# EAGLE schematic BoardSchem (EAGLE 9.6.2)

## Sheet 1 of 7: Power
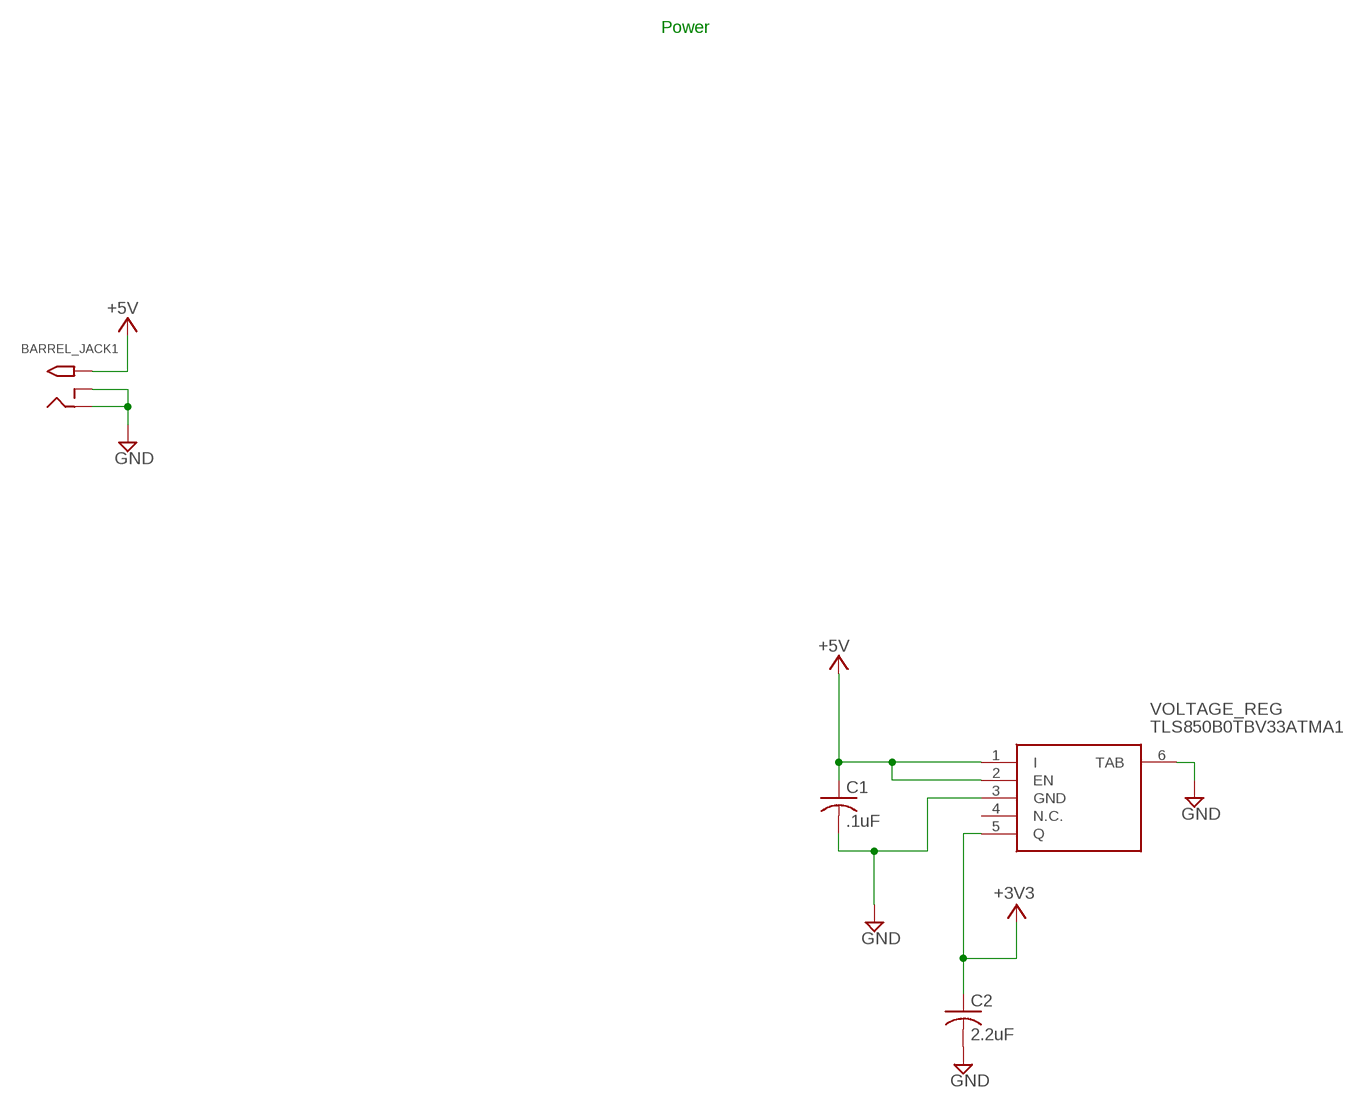
[diagram p0: schematic, sheet 1]

### Parts
BARREL_JACK1  2.1MMJACKTHM  [PJ-102A]
C1  .1uF  C-USC0805  [C0805]
C2  2.2uF  C-USC0805  [C0805]
VOLTAGE_REG  TLS850B0TBV33ATMA1  [TLS850B0TBV33ATMA1]

### Nets
+3V3: C2.1 VOLTAGE_REG.5(Q) ; also sheet 2
+5V: BARREL_JACK1.TIP C1.1 VOLTAGE_REG.1(I) VOLTAGE_REG.2(EN) ; also sheet 2,3,4,5,6,7
GND: BARREL_JACK1.RING BARREL_JACK1.RING_SW C1.2 C2.2 VOLTAGE_REG.3(GND) VOLTAGE_REG.6(TAB) ; also sheet 2,3,4,5,6,7
Unconnected: VOLTAGE_REG.4(N.C.)

### Notes on the sheet
- Power

## Sheet 2 of 7: Controling ICs
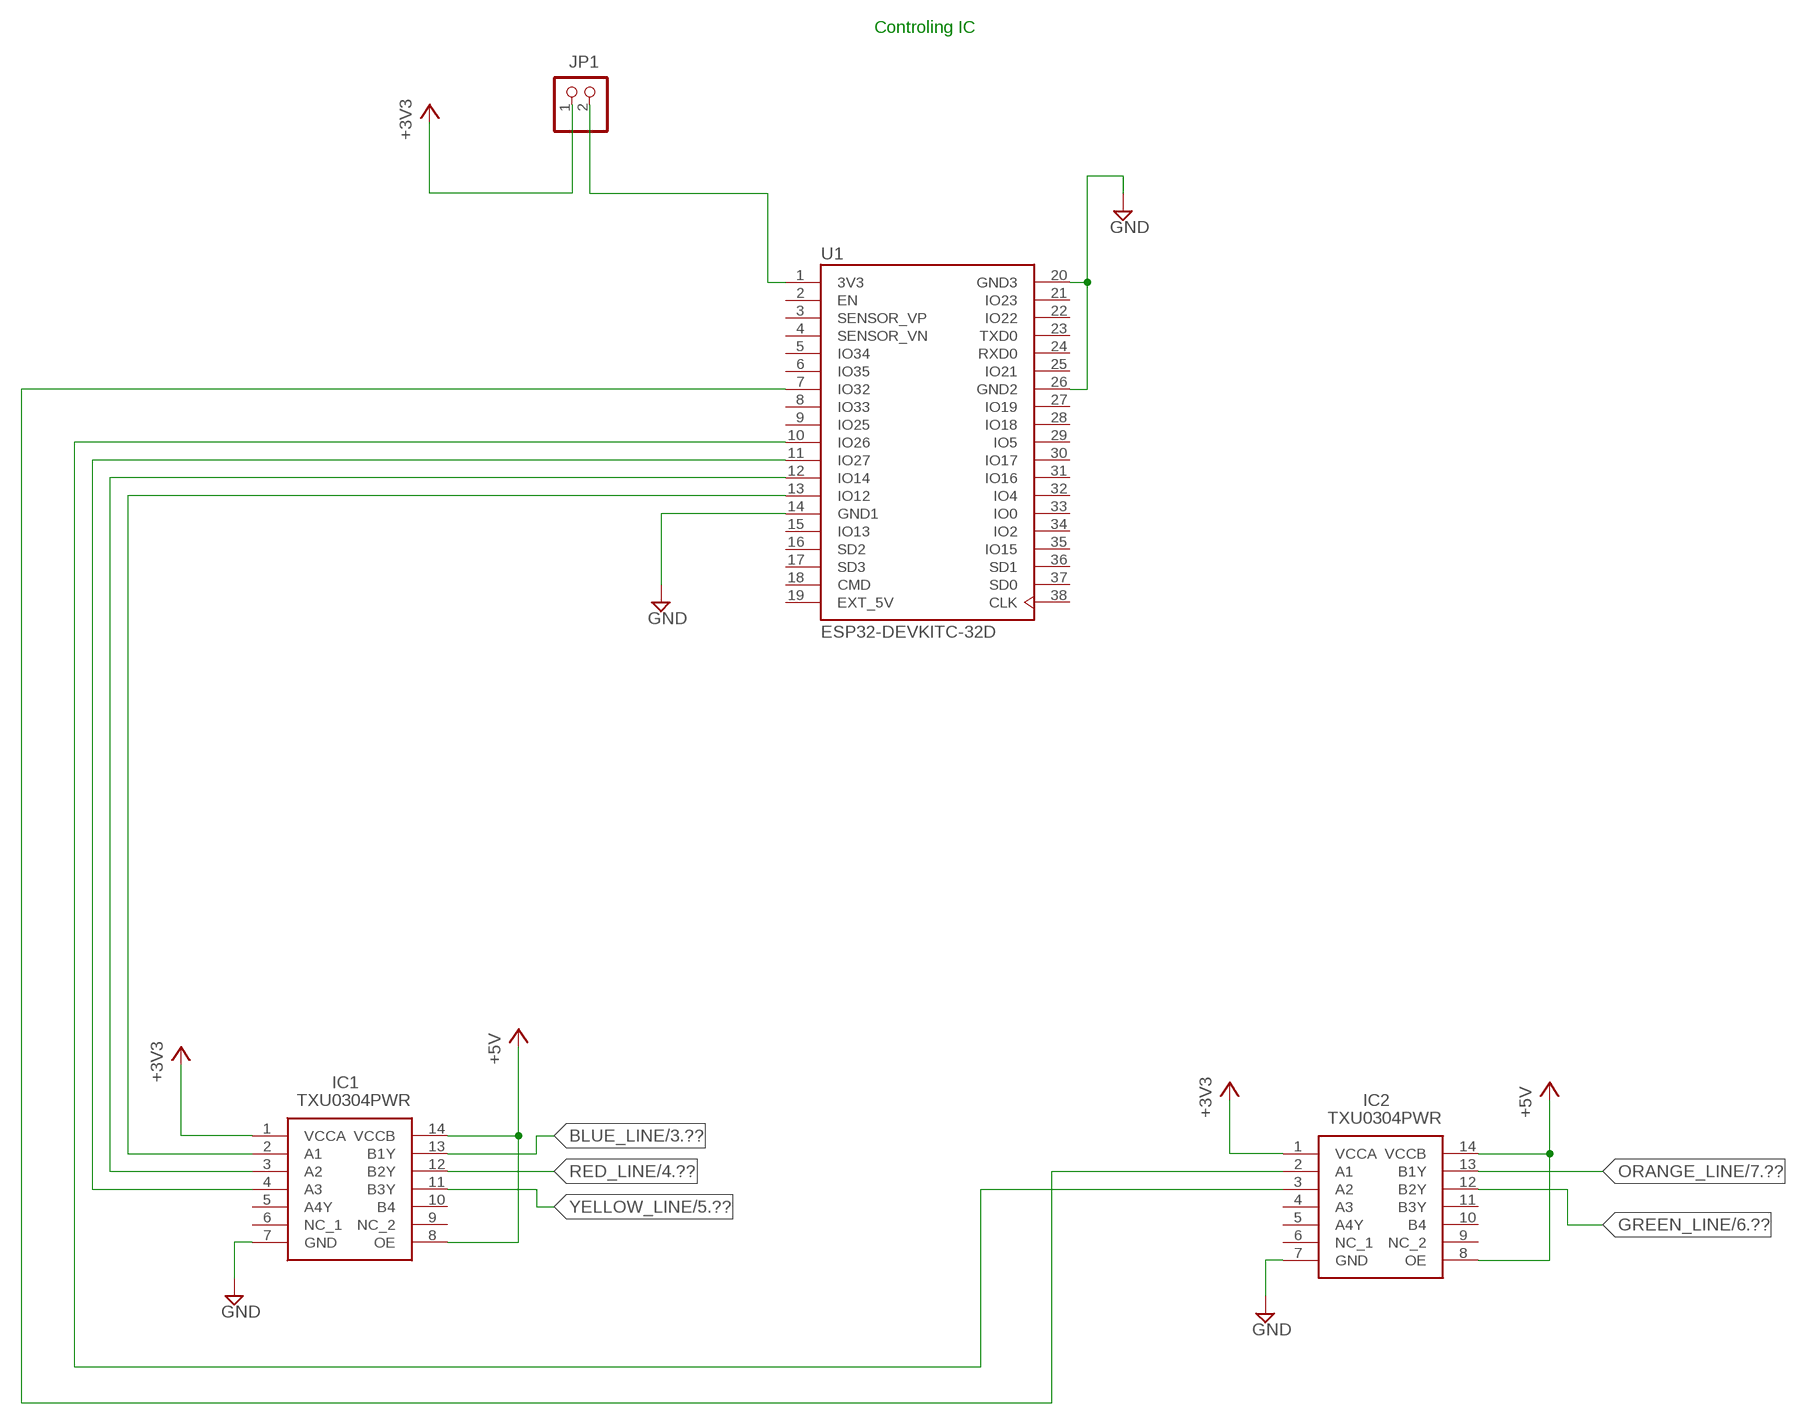
[diagram p1: schematic, sheet 2]

### Parts
IC1  TXU0304PWR  [SOP65P640X120-14N]
IC2  TXU0304PWR  [SOP65P640X120-14N]
JP1  PINHD-1X2  [1X02]
U1  ESP32-DEVKITC-32D  [MODULE_ESP32-DEVKITC-32D]

### Nets
+3V3: IC1.1(VCCA) IC2.1(VCCA) JP1.1 ; also sheet 1
+5V: IC1.8(OE) IC1.14(VCCB) IC2.8(OE) IC2.14(VCCB) ; also sheet 1,3,4,5,6,7
BLUE_LINE: IC1.13(B1Y) ; also sheet 3
GND: IC1.7(GND) IC2.7(GND) U1.14(GND1) U1.20(GND3) U1.26(GND2) ; also sheet 1,3,4,5,6,7
GREEN_LINE: IC2.12(B2Y) ; also sheet 6
N$1: JP1.2 U1.1(3V3)
N$141: IC1.2(A1) U1.13(IO12)
N$142: IC1.3(A2) U1.12(IO14)
N$144: IC1.4(A3) U1.11(IO27)
N$145: IC2.3(A2) U1.10(IO26)
N$146: IC2.2(A1) U1.7(IO32)
ORANGE_LINE: IC2.13(B1Y) ; also sheet 7
RED_LINE: IC1.12(B2Y) ; also sheet 4
YELLOW_LINE: IC1.11(B3Y) ; also sheet 5
Unconnected: IC1.5(A4Y) IC1.6(NC_1) IC1.9(NC_2) IC1.10(B4) IC2.4(A3) IC2.5(A4Y) IC2.6(NC_1) IC2.9(NC_2) IC2.10(B4) IC2.11(B3Y) U1.2(EN) U1.3(SENSOR_VP) U1.4(SENSOR_VN) U1.5(IO34) U1.6(IO35) U1.8(IO33) U1.9(IO25) U1.15(IO13) U1.16(SD2) U1.17(SD3) U1.18(CMD) U1.21(IO23) U1.22(IO22) U1.23(TXD0) U1.24(RXD0) U1.25(IO21) U1.27(IO19) U1.28(IO18) U1.29(IO5) U1.30(IO17) U1.31(IO16) U1.32(IO4) U1.33(IO0) U1.34(IO2) U1.35(IO15) U1.36(SD1) U1.37(SD0) U1.38(CLK)

### Notes on the sheet
- Controling IC

## Sheet 3 of 7: Blue Line
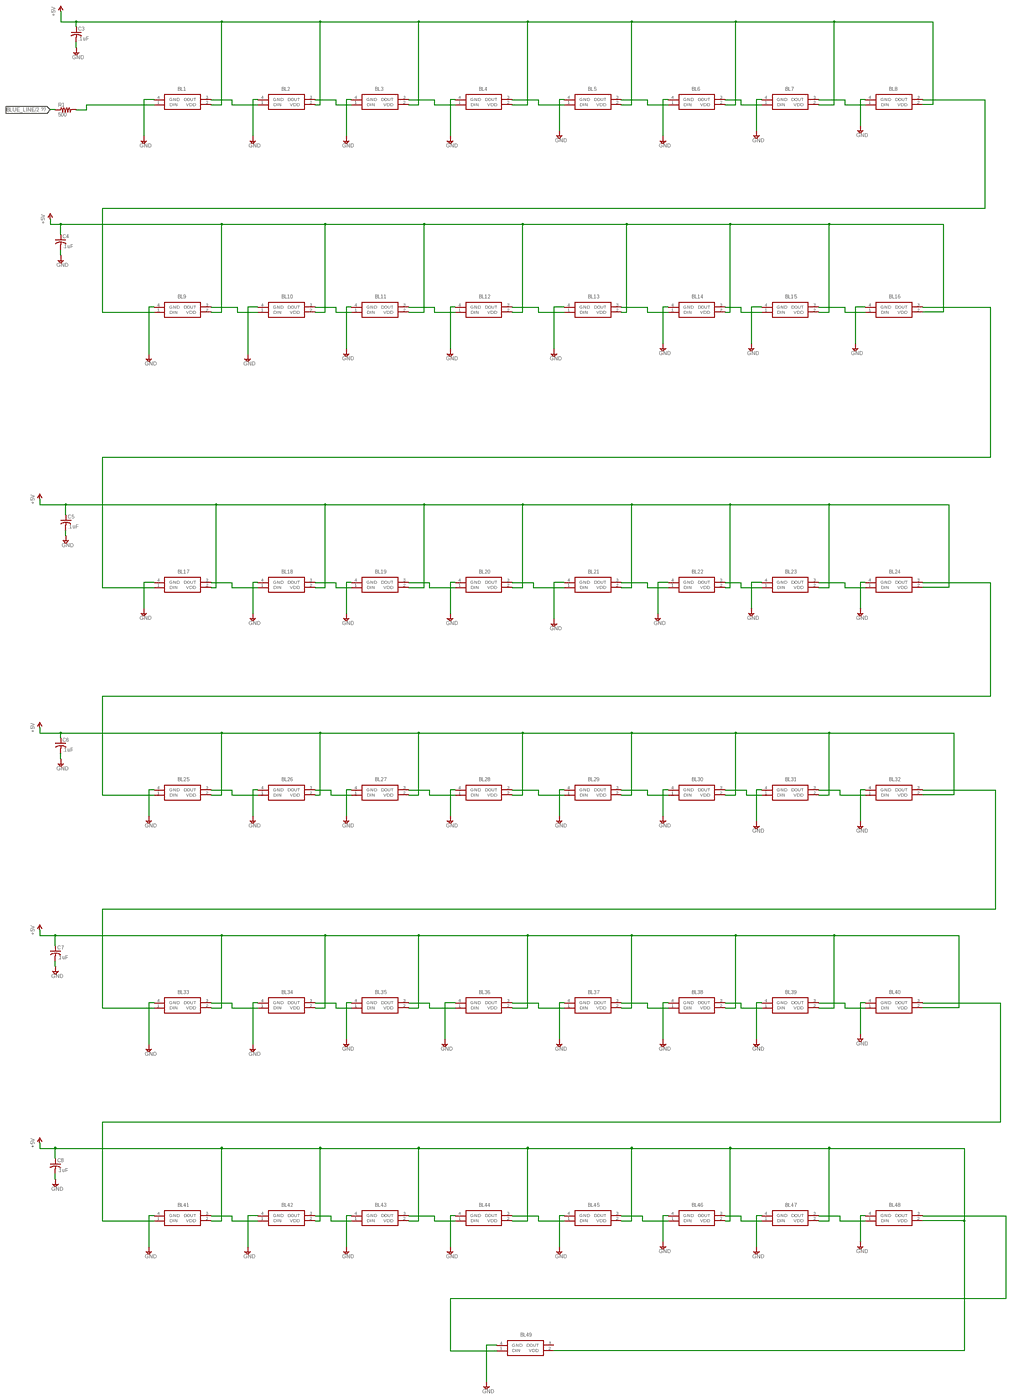
[diagram p2: schematic, sheet 3, overview]
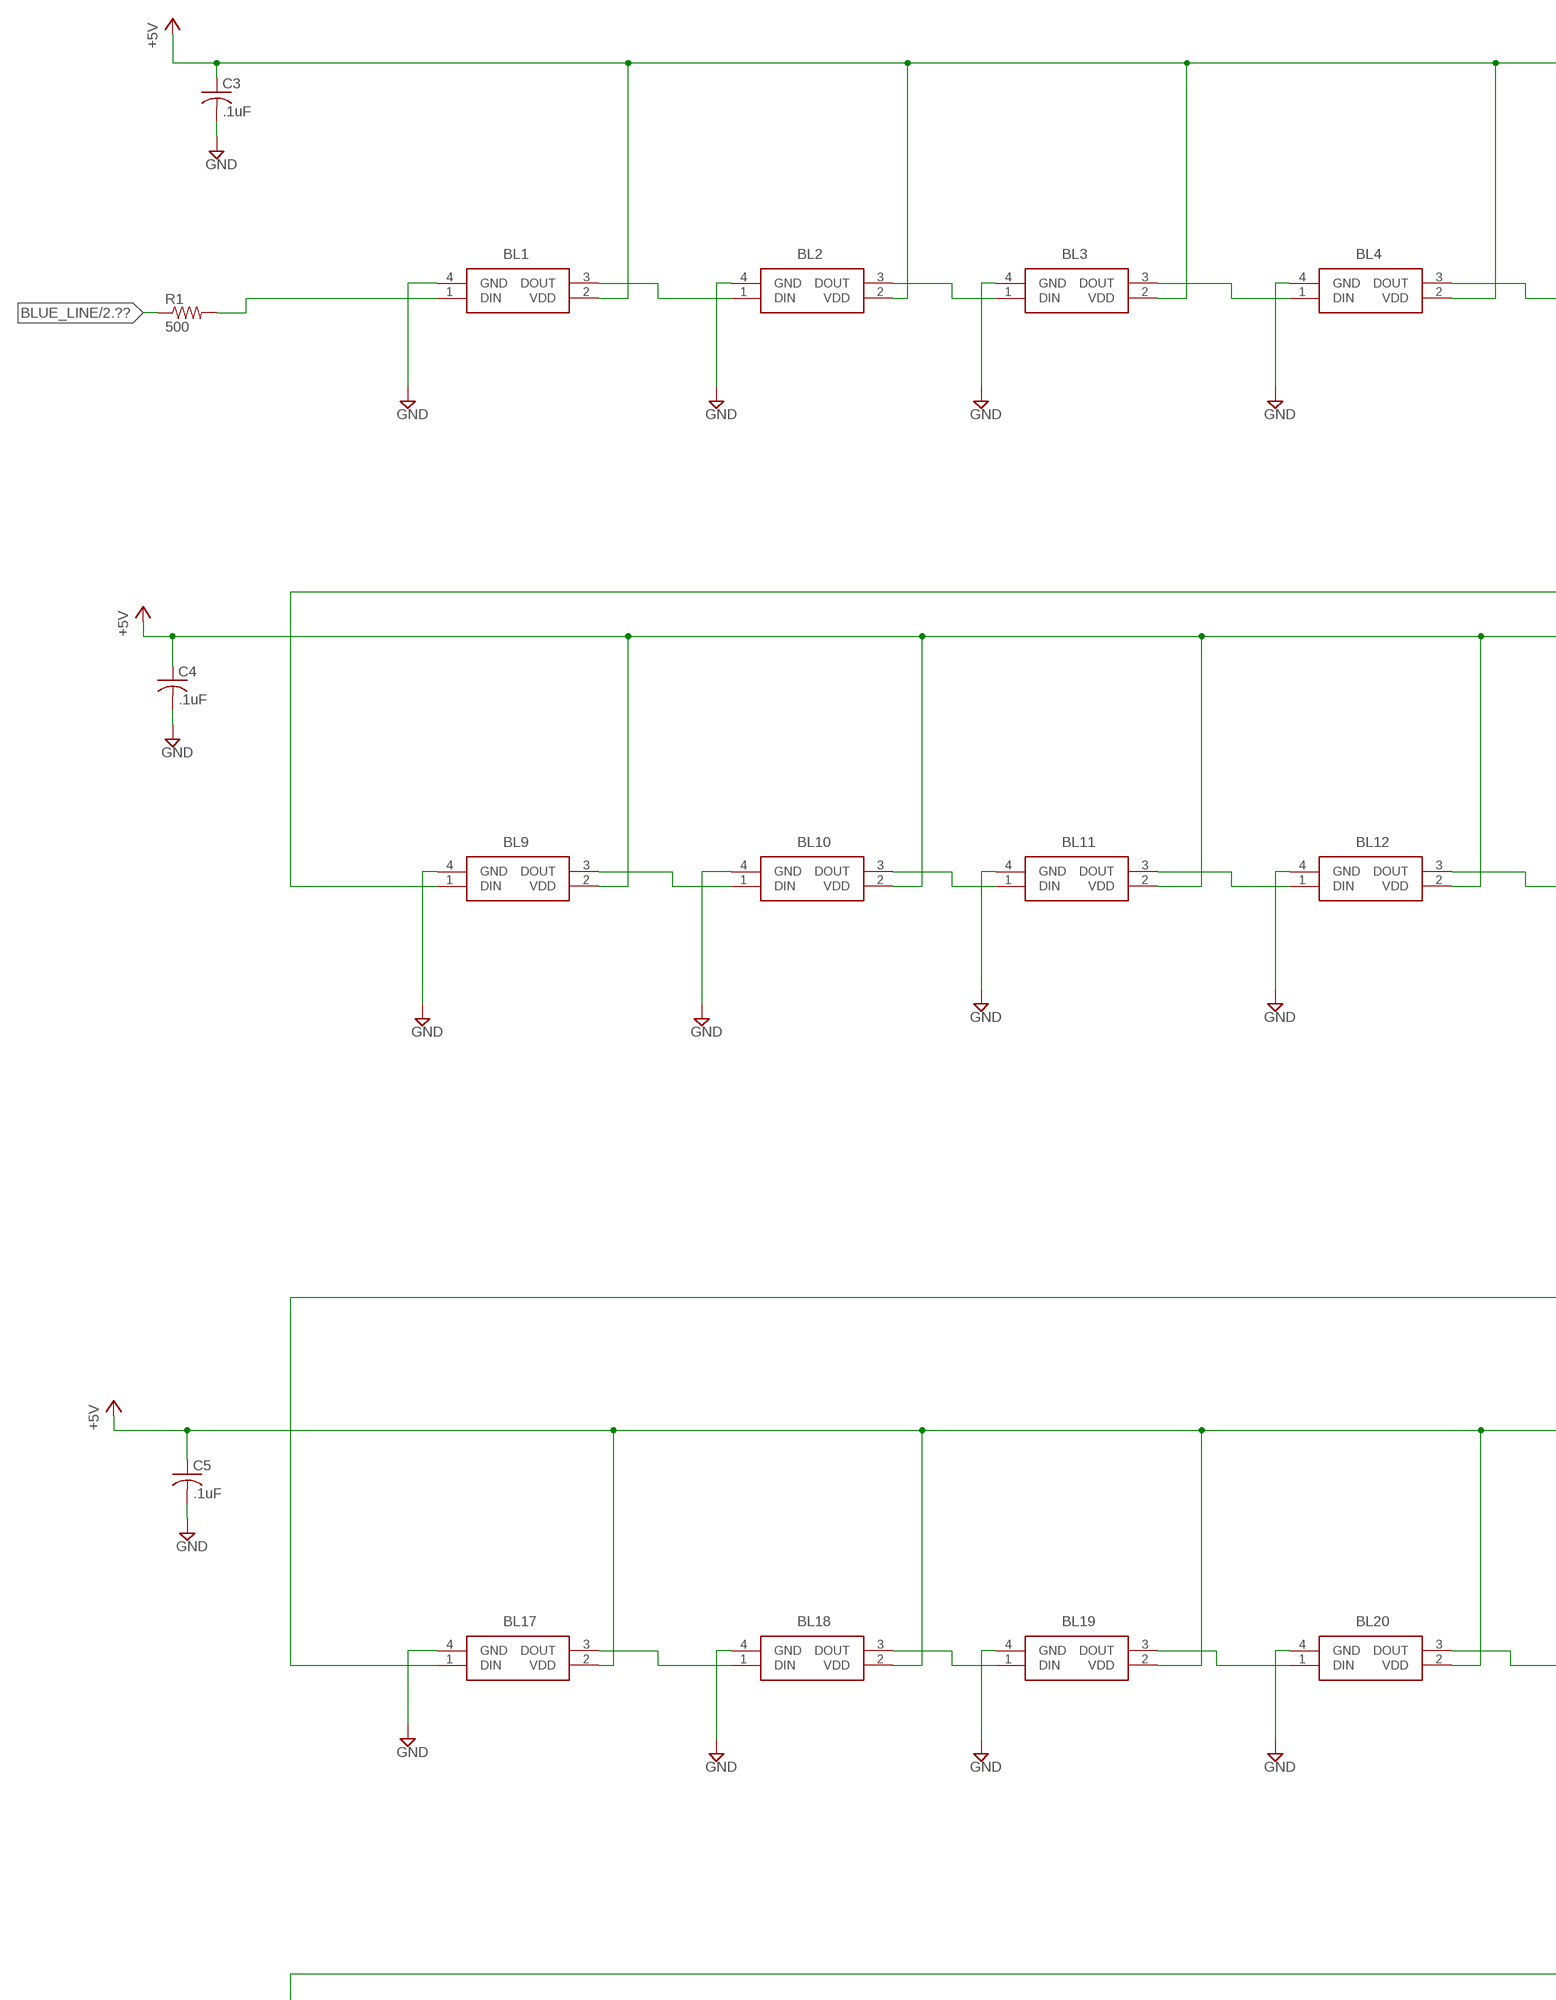
[diagram p3: schematic, sheet 3, part 1 of 4]
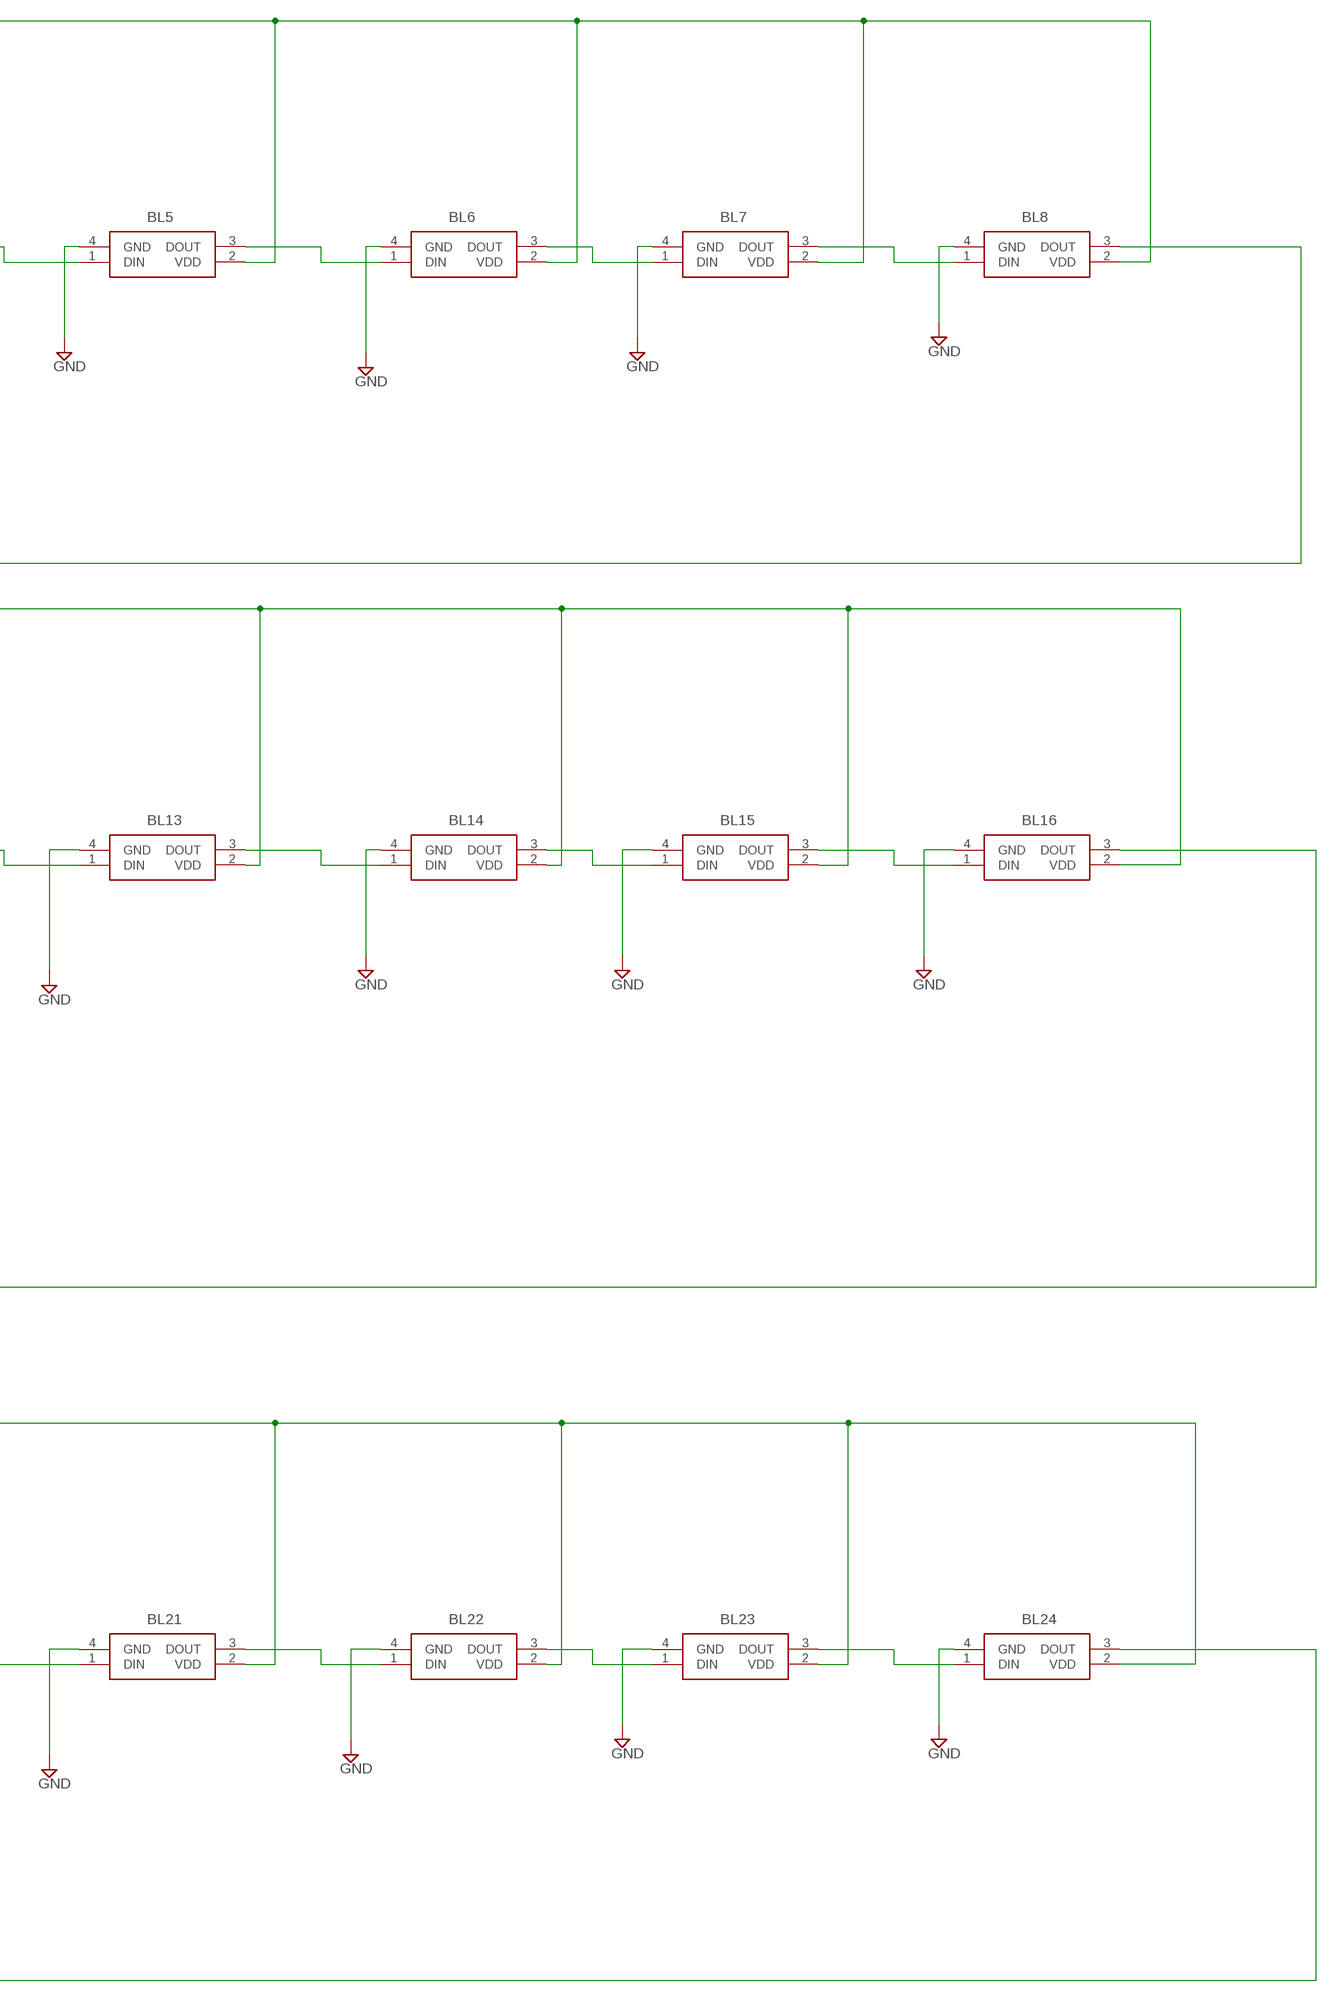
[diagram p4: schematic, sheet 3, part 2 of 4]
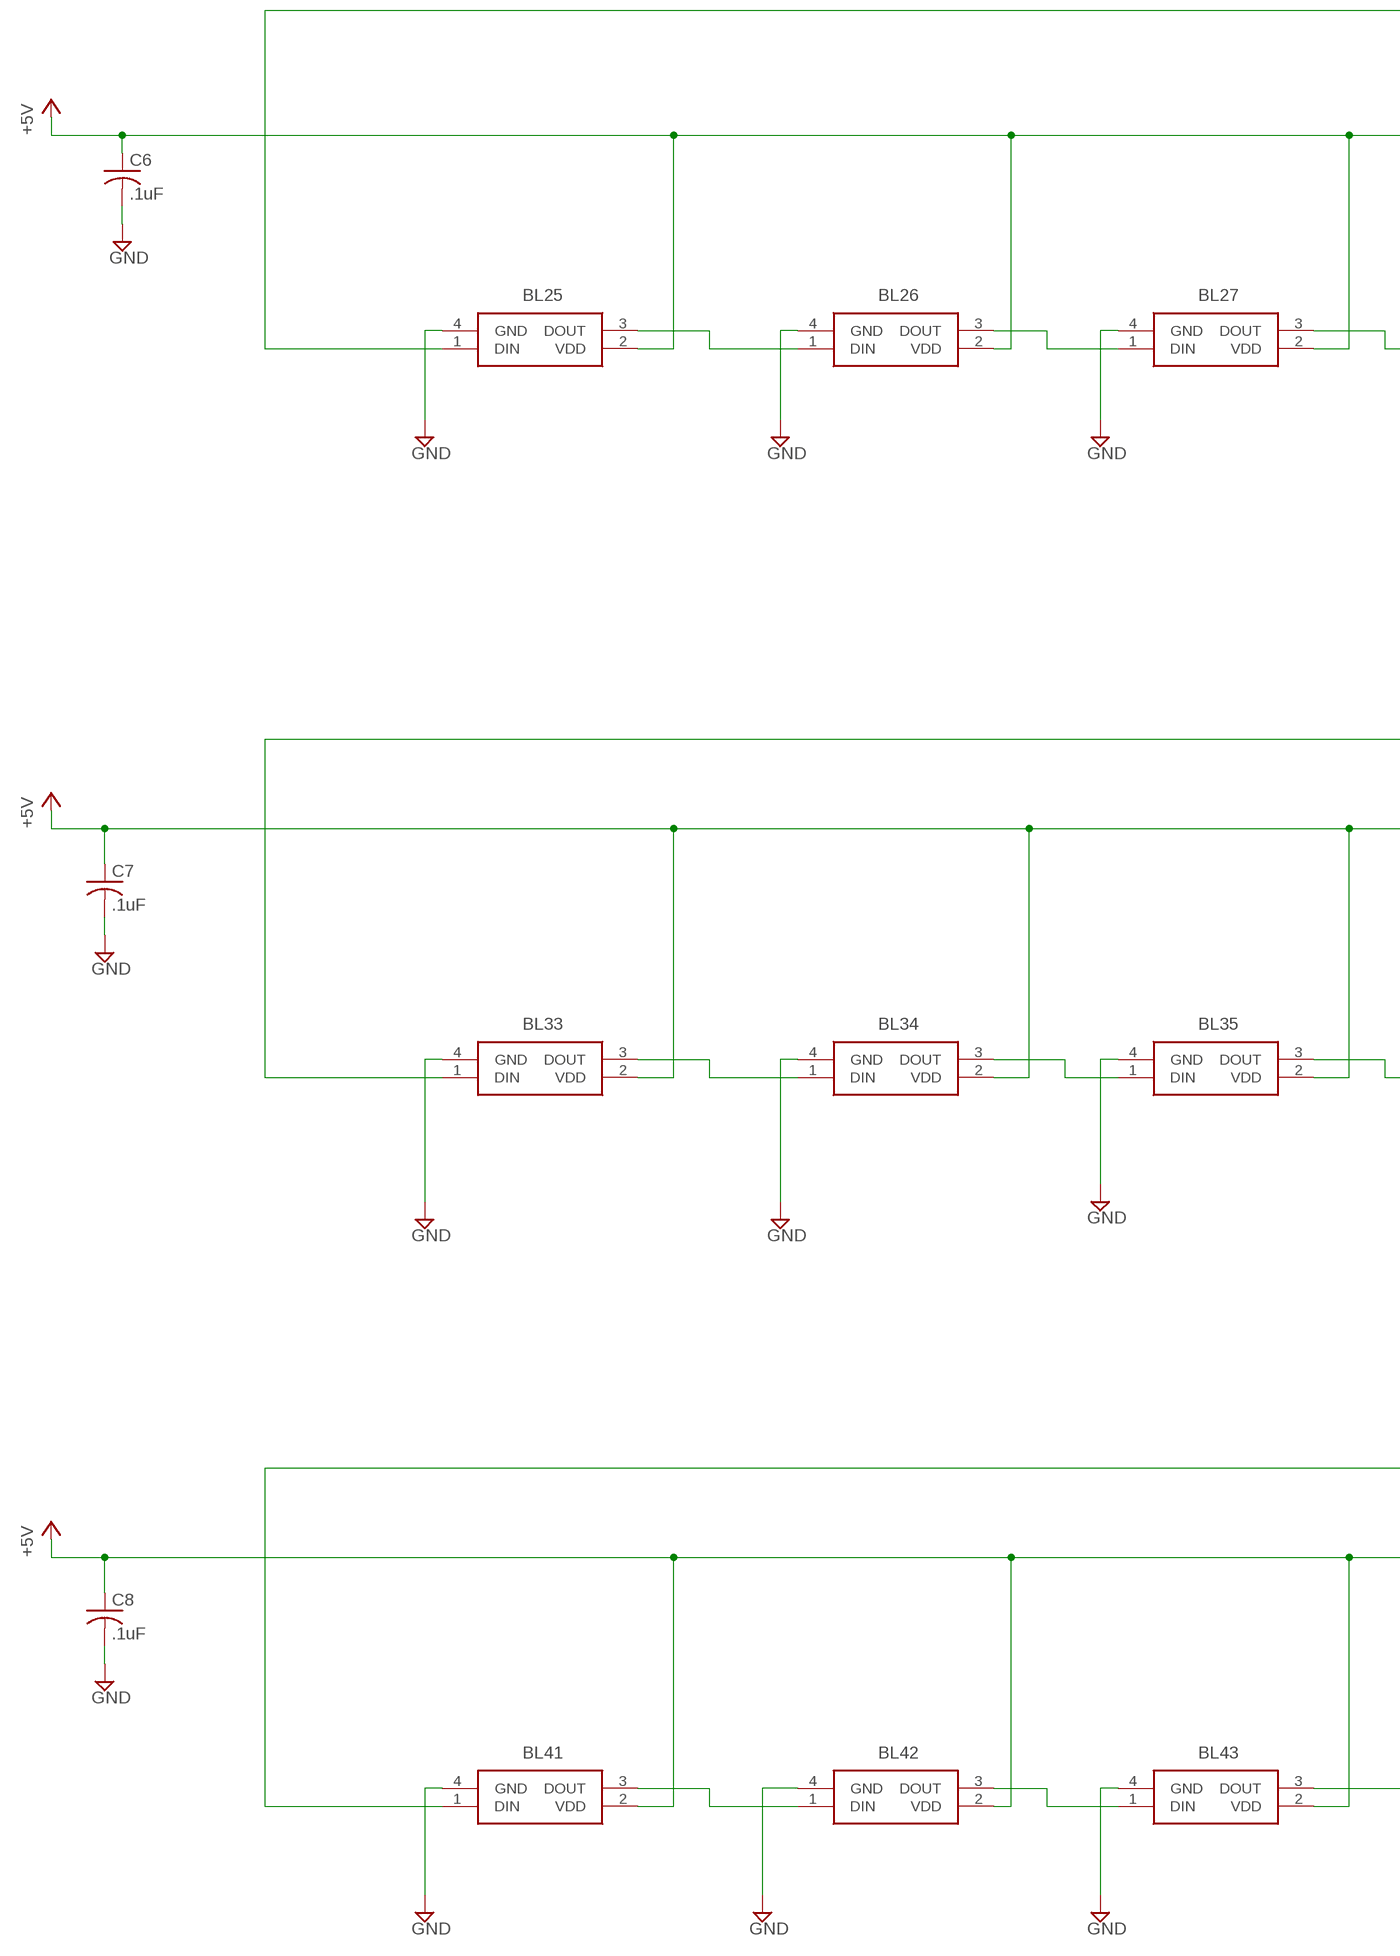
[diagram p5: schematic, sheet 3, part 3 of 4]
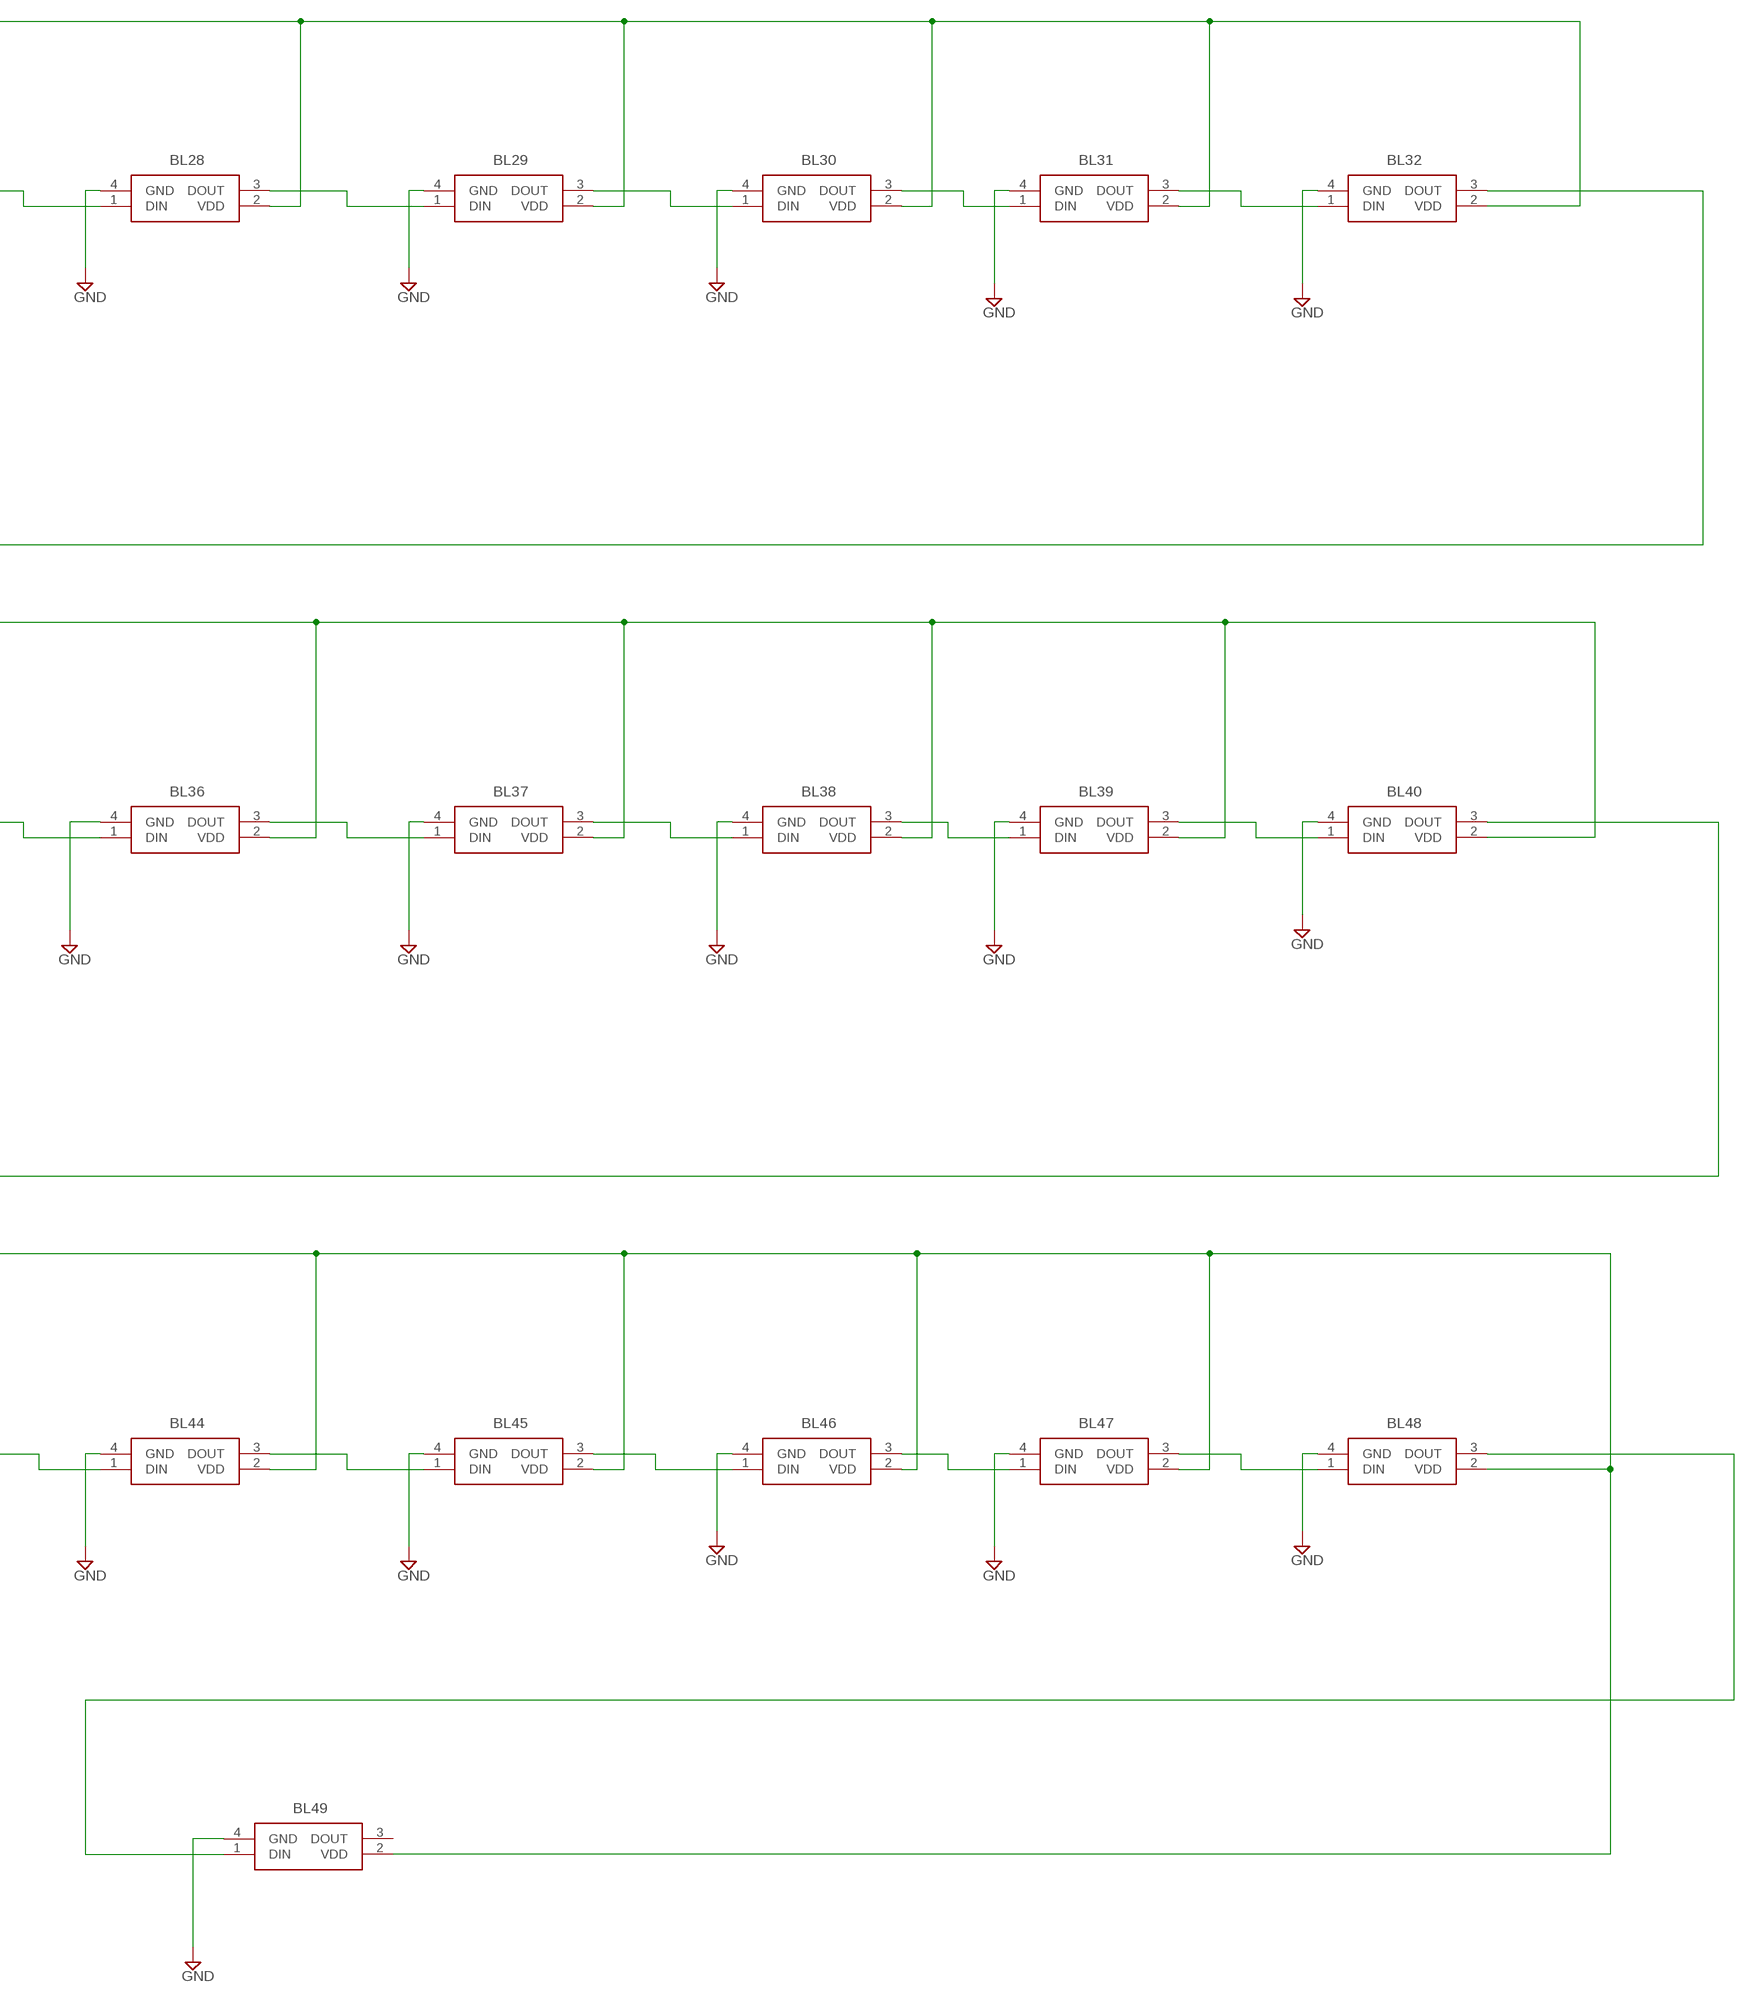
[diagram p6: schematic, sheet 3, part 4 of 4]

### Parts
BL1  4492__SK6805-EC_15_  [4492SK6805EC15]
BL2  4492__SK6805-EC_15_  [4492SK6805EC15]
BL3  4492__SK6805-EC_15_  [4492SK6805EC15]
BL4  4492__SK6805-EC_15_  [4492SK6805EC15]
BL5  4492__SK6805-EC_15_  [4492SK6805EC15]
BL6  4492__SK6805-EC_15_  [4492SK6805EC15]
BL7  4492__SK6805-EC_15_  [4492SK6805EC15]
BL8  4492__SK6805-EC_15_  [4492SK6805EC15]
BL9  4492__SK6805-EC_15_  [4492SK6805EC15]
BL10  4492__SK6805-EC_15_  [4492SK6805EC15]
BL11  4492__SK6805-EC_15_  [4492SK6805EC15]
BL12  4492__SK6805-EC_15_  [4492SK6805EC15]
BL13  4492__SK6805-EC_15_  [4492SK6805EC15]
BL14  4492__SK6805-EC_15_  [4492SK6805EC15]
BL15  4492__SK6805-EC_15_  [4492SK6805EC15]
BL16  4492__SK6805-EC_15_  [4492SK6805EC15]
BL17  4492__SK6805-EC_15_  [4492SK6805EC15]
BL18  4492__SK6805-EC_15_  [4492SK6805EC15]
BL19  4492__SK6805-EC_15_  [4492SK6805EC15]
BL20  4492__SK6805-EC_15_  [4492SK6805EC15]
BL21  4492__SK6805-EC_15_  [4492SK6805EC15]
BL22  4492__SK6805-EC_15_  [4492SK6805EC15]
BL23  4492__SK6805-EC_15_  [4492SK6805EC15]
BL24  4492__SK6805-EC_15_  [4492SK6805EC15]
BL25  4492__SK6805-EC_15_  [4492SK6805EC15]
BL26  4492__SK6805-EC_15_  [4492SK6805EC15]
BL27  4492__SK6805-EC_15_  [4492SK6805EC15]
BL28  4492__SK6805-EC_15_  [4492SK6805EC15]
BL29  4492__SK6805-EC_15_  [4492SK6805EC15]
BL30  4492__SK6805-EC_15_  [4492SK6805EC15]
BL31  4492__SK6805-EC_15_  [4492SK6805EC15]
BL32  4492__SK6805-EC_15_  [4492SK6805EC15]
BL33  4492__SK6805-EC_15_  [4492SK6805EC15]
BL34  4492__SK6805-EC_15_  [4492SK6805EC15]
BL35  4492__SK6805-EC_15_  [4492SK6805EC15]
BL36  4492__SK6805-EC_15_  [4492SK6805EC15]
BL37  4492__SK6805-EC_15_  [4492SK6805EC15]
BL38  4492__SK6805-EC_15_  [4492SK6805EC15]
BL39  4492__SK6805-EC_15_  [4492SK6805EC15]
BL40  4492__SK6805-EC_15_  [4492SK6805EC15]
BL41  4492__SK6805-EC_15_  [4492SK6805EC15]
BL42  4492__SK6805-EC_15_  [4492SK6805EC15]
BL43  4492__SK6805-EC_15_  [4492SK6805EC15]
BL44  4492__SK6805-EC_15_  [4492SK6805EC15]
BL45  4492__SK6805-EC_15_  [4492SK6805EC15]
BL46  4492__SK6805-EC_15_  [4492SK6805EC15]
BL47  4492__SK6805-EC_15_  [4492SK6805EC15]
BL48  4492__SK6805-EC_15_  [4492SK6805EC15]
BL49  4492__SK6805-EC_15_  [4492SK6805EC15]
C3  .1uF  C-USC0805  [C0805]
C4  .1uF  C-USC0805  [C0805]
C5  .1uF  C-USC0805  [C0805]
C6  .1uF  C-USC0805  [C0805]
C7  .1uF  C-USC0805  [C0805]
C8  .1uF  C-USC0805  [C0805]
R1  500  R-US_R0805  [R0805]

### Nets
+5V: BL1.2(VDD) BL2.2(VDD) BL3.2(VDD) BL4.2(VDD) BL5.2(VDD) BL6.2(VDD) BL7.2(VDD) BL8.2(VDD) BL9.2(VDD) BL10.2(VDD) BL11.2(VDD) BL12.2(VDD) BL13.2(VDD) BL14.2(VDD) BL15.2(VDD) BL16.2(VDD) BL17.2(VDD) BL18.2(VDD) BL19.2(VDD) BL20.2(VDD) BL21.2(VDD) BL22.2(VDD) BL23.2(VDD) BL24.2(VDD) BL25.2(VDD) BL26.2(VDD) BL27.2(VDD) BL28.2(VDD) BL29.2(VDD) BL30.2(VDD) BL31.2(VDD) BL32.2(VDD) BL33.2(VDD) BL34.2(VDD) BL35.2(VDD) BL36.2(VDD) BL37.2(VDD) BL38.2(VDD) BL39.2(VDD) BL40.2(VDD) BL41.2(VDD) BL42.2(VDD) BL43.2(VDD) BL44.2(VDD) BL45.2(VDD) BL46.2(VDD) BL47.2(VDD) BL48.2(VDD) BL49.2(VDD) C3.1 C4.1 C5.1 C6.1 C7.1 C8.1 ; also sheet 1,2,4,5,6,7
BLUE_LINE: R1.1 ; also sheet 2
GND: BL1.4(GND) BL2.4(GND) BL3.4(GND) BL4.4(GND) BL5.4(GND) BL6.4(GND) BL7.4(GND) BL8.4(GND) BL9.4(GND) BL10.4(GND) BL11.4(GND) BL12.4(GND) BL13.4(GND) BL14.4(GND) BL15.4(GND) BL16.4(GND) BL17.4(GND) BL18.4(GND) BL19.4(GND) BL20.4(GND) BL21.4(GND) BL22.4(GND) BL23.4(GND) BL24.4(GND) BL25.4(GND) BL26.4(GND) BL27.4(GND) BL28.4(GND) BL29.4(GND) BL30.4(GND) BL31.4(GND) BL32.4(GND) BL33.4(GND) BL34.4(GND) BL35.4(GND) BL36.4(GND) BL37.4(GND) BL38.4(GND) BL39.4(GND) BL40.4(GND) BL41.4(GND) BL42.4(GND) BL43.4(GND) BL44.4(GND) BL45.4(GND) BL46.4(GND) BL47.4(GND) BL48.4(GND) BL49.4(GND) C3.2 C4.2 C5.2 C6.2 C7.2 C8.2 ; also sheet 1,2,4,5,6,7
N$2: BL1.3(DOUT) BL2.1(DIN)
N$3: BL2.3(DOUT) BL3.1(DIN)
N$4: BL3.3(DOUT) BL4.1(DIN)
N$5: BL4.3(DOUT) BL5.1(DIN)
N$6: BL5.3(DOUT) BL6.1(DIN)
N$7: BL6.3(DOUT) BL7.1(DIN)
N$8: BL7.3(DOUT) BL8.1(DIN)
N$9: BL8.3(DOUT) BL9.1(DIN)
N$10: BL9.3(DOUT) BL10.1(DIN)
N$11: BL10.3(DOUT) BL11.1(DIN)
N$12: BL11.3(DOUT) BL12.1(DIN)
N$13: BL12.3(DOUT) BL13.1(DIN)
N$14: BL13.3(DOUT) BL14.1(DIN)
N$15: BL14.3(DOUT) BL15.1(DIN)
N$16: BL15.3(DOUT) BL16.1(DIN)
N$17: BL16.3(DOUT) BL17.1(DIN)
N$18: BL17.3(DOUT) BL18.1(DIN)
N$19: BL18.3(DOUT) BL19.1(DIN)
N$20: BL19.3(DOUT) BL20.1(DIN)
N$21: BL20.3(DOUT) BL21.1(DIN)
N$22: BL21.3(DOUT) BL22.1(DIN)
N$23: BL22.3(DOUT) BL23.1(DIN)
N$24: BL23.3(DOUT) BL24.1(DIN)
N$25: BL24.3(DOUT) BL25.1(DIN)
N$26: BL25.3(DOUT) BL26.1(DIN)
N$27: BL26.3(DOUT) BL27.1(DIN)
N$28: BL27.3(DOUT) BL28.1(DIN)
N$29: BL28.3(DOUT) BL29.1(DIN)
N$30: BL29.3(DOUT) BL30.1(DIN)
N$31: BL30.3(DOUT) BL31.1(DIN)
N$32: BL31.3(DOUT) BL32.1(DIN)
N$33: BL32.3(DOUT) BL33.1(DIN)
N$34: BL33.3(DOUT) BL34.1(DIN)
N$35: BL34.3(DOUT) BL35.1(DIN)
N$36: BL35.3(DOUT) BL36.1(DIN)
N$37: BL36.3(DOUT) BL37.1(DIN)
N$38: BL37.3(DOUT) BL38.1(DIN)
N$39: BL38.3(DOUT) BL39.1(DIN)
N$40: BL39.3(DOUT) BL40.1(DIN)
N$41: BL40.3(DOUT) BL41.1(DIN)
N$42: BL41.3(DOUT) BL42.1(DIN)
N$43: BL42.3(DOUT) BL43.1(DIN)
N$44: BL43.3(DOUT) BL44.1(DIN)
N$45: BL44.3(DOUT) BL45.1(DIN)
N$46: BL45.3(DOUT) BL46.1(DIN)
N$47: BL46.3(DOUT) BL47.1(DIN)
N$48: BL47.3(DOUT) BL48.1(DIN)
N$49: BL48.3(DOUT) BL49.1(DIN)
N$52: BL1.1(DIN) R1.2
Unconnected: BL49.3(DOUT)

## Sheet 4 of 7: Red Line
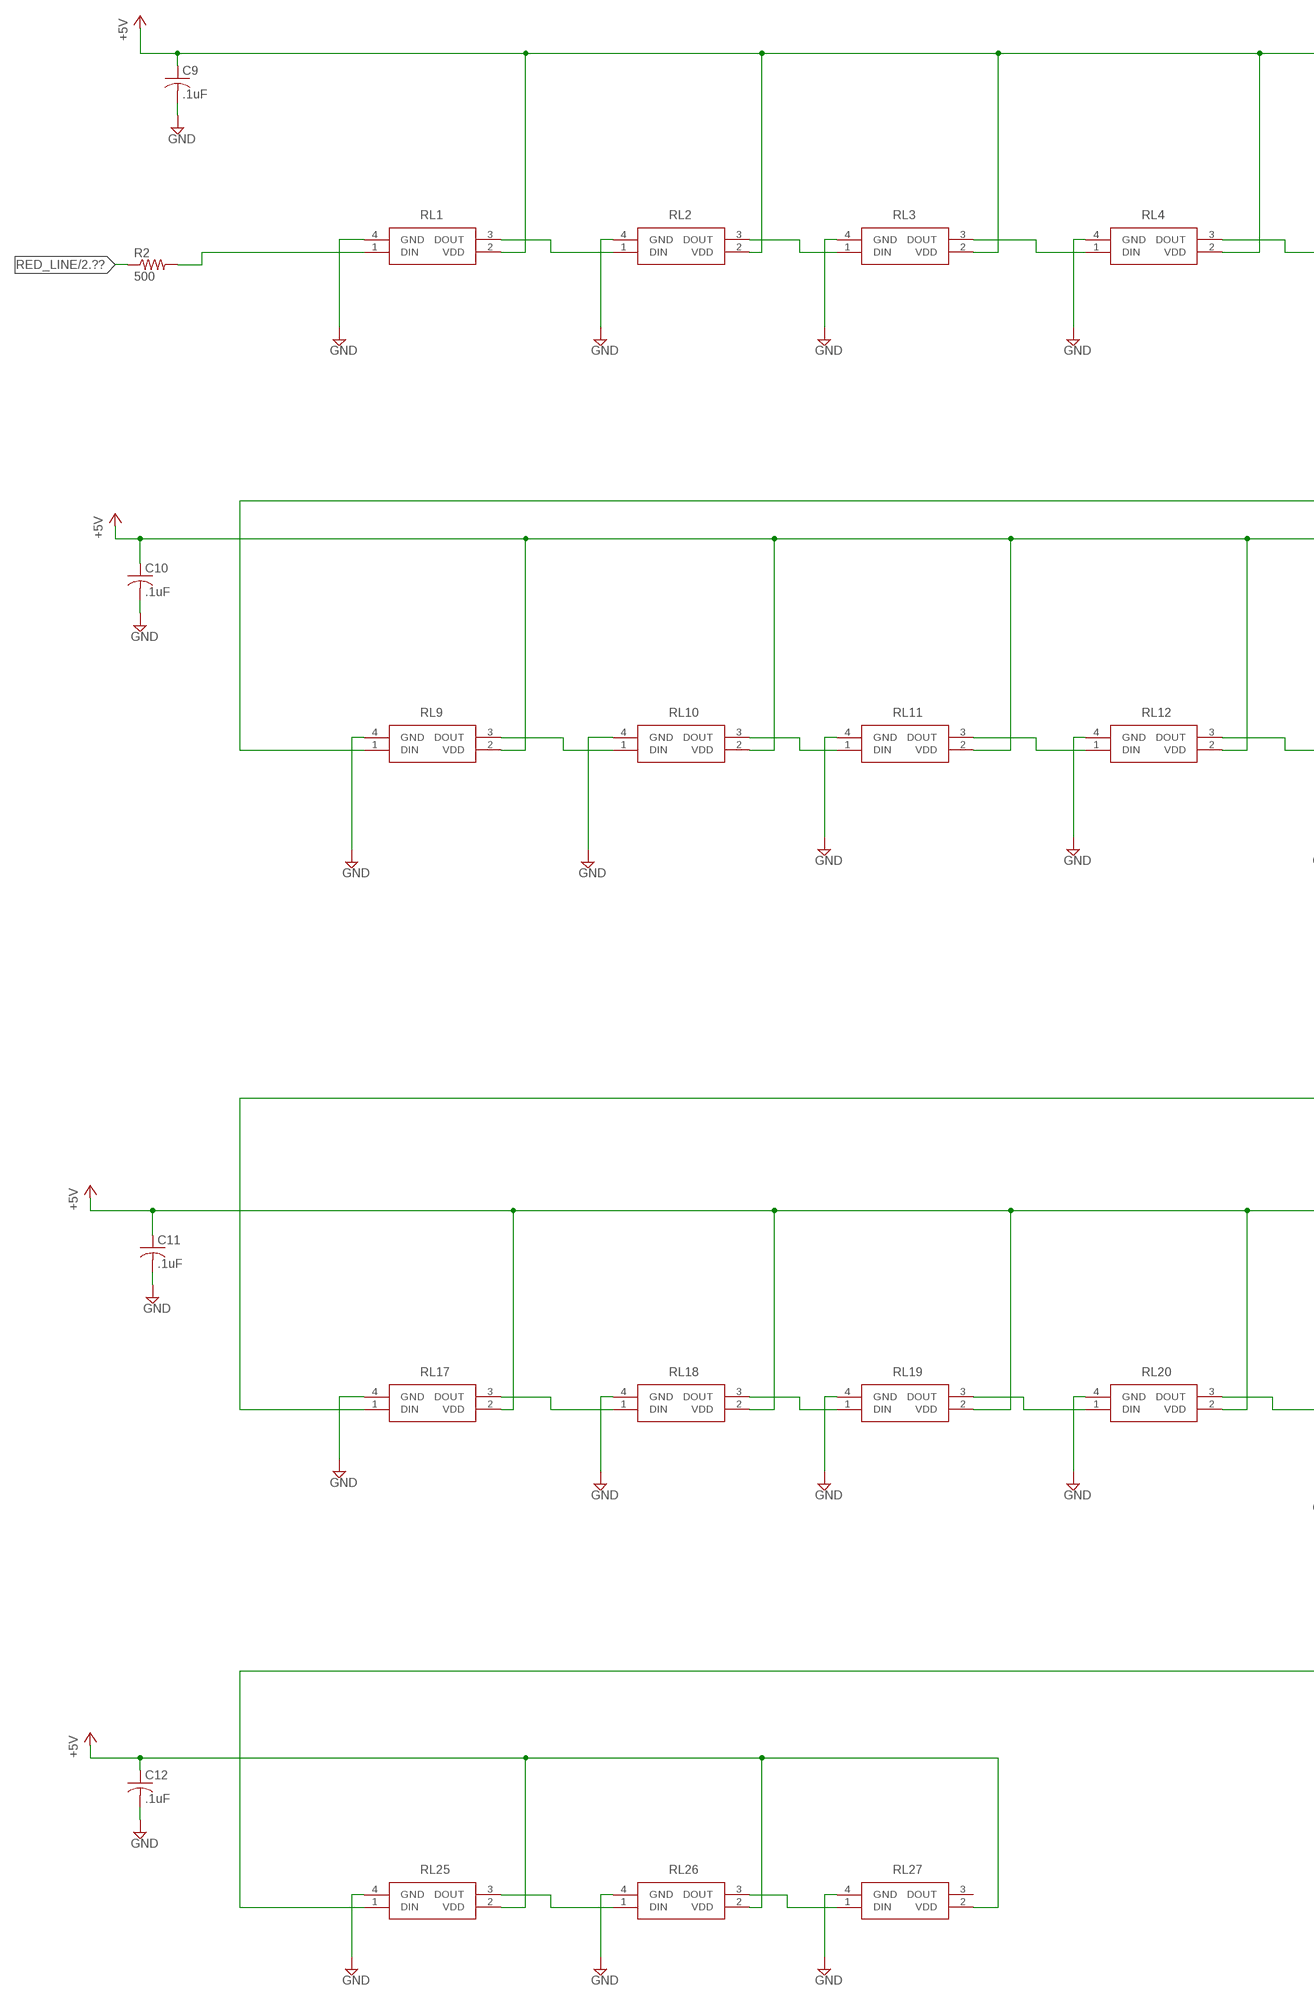
[diagram p7: schematic, sheet 4, part 1 of 2]
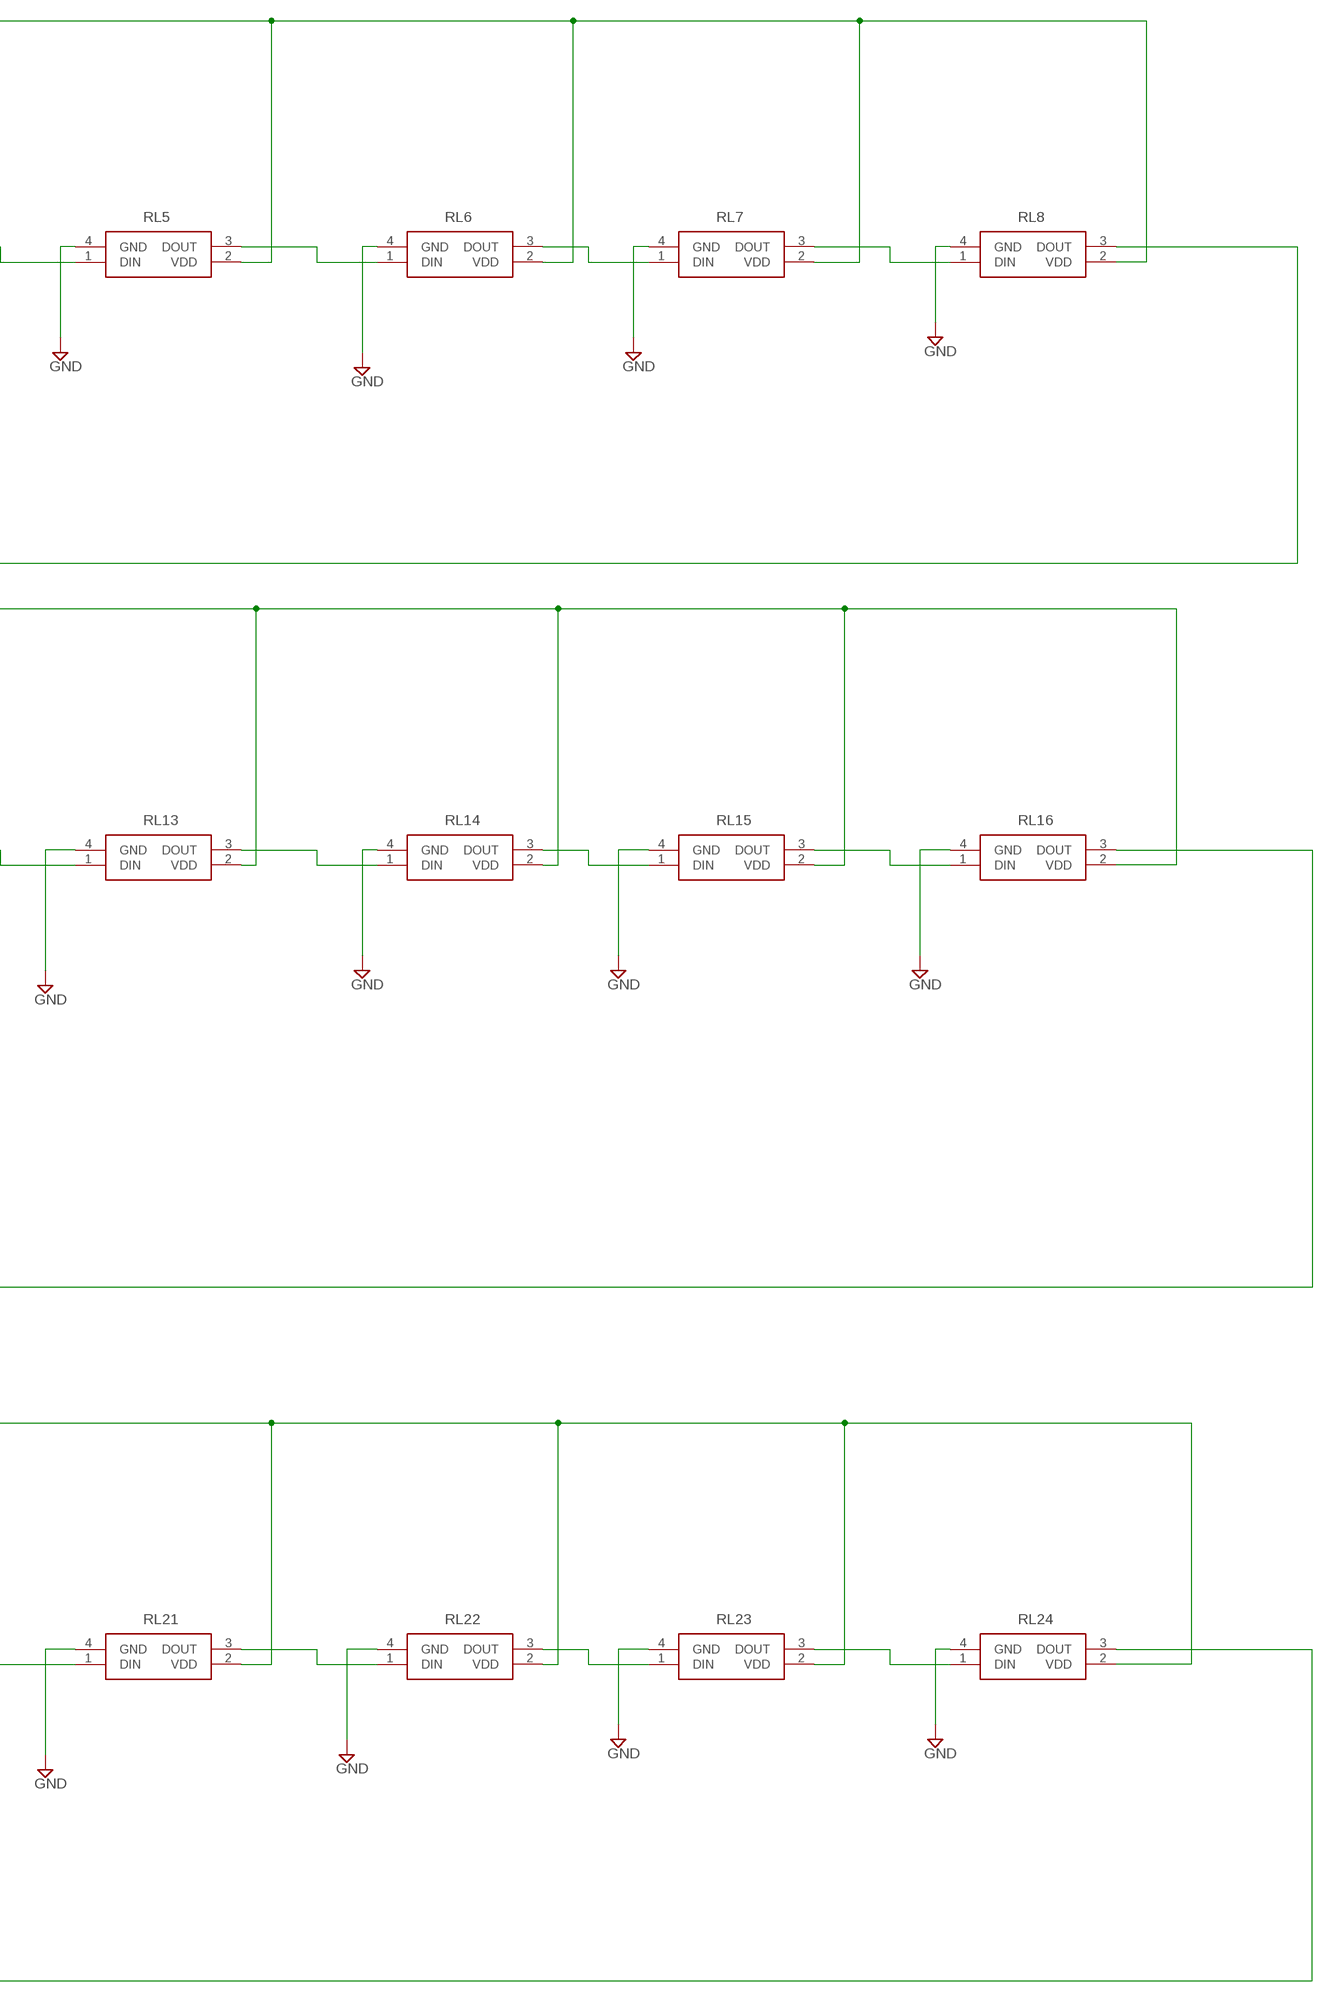
[diagram p8: schematic, sheet 4, part 2 of 2]

### Parts
C9  .1uF  C-USC0805  [C0805]
C10  .1uF  C-USC0805  [C0805]
C11  .1uF  C-USC0805  [C0805]
C12  .1uF  C-USC0805  [C0805]
R2  500  R-US_R0805  [R0805]
RL1  4492__SK6805-EC_15_  [4492SK6805EC15]
RL2  4492__SK6805-EC_15_  [4492SK6805EC15]
RL3  4492__SK6805-EC_15_  [4492SK6805EC15]
RL4  4492__SK6805-EC_15_  [4492SK6805EC15]
RL5  4492__SK6805-EC_15_  [4492SK6805EC15]
RL6  4492__SK6805-EC_15_  [4492SK6805EC15]
RL7  4492__SK6805-EC_15_  [4492SK6805EC15]
RL8  4492__SK6805-EC_15_  [4492SK6805EC15]
RL9  4492__SK6805-EC_15_  [4492SK6805EC15]
RL10  4492__SK6805-EC_15_  [4492SK6805EC15]
RL11  4492__SK6805-EC_15_  [4492SK6805EC15]
RL12  4492__SK6805-EC_15_  [4492SK6805EC15]
RL13  4492__SK6805-EC_15_  [4492SK6805EC15]
RL14  4492__SK6805-EC_15_  [4492SK6805EC15]
RL15  4492__SK6805-EC_15_  [4492SK6805EC15]
RL16  4492__SK6805-EC_15_  [4492SK6805EC15]
RL17  4492__SK6805-EC_15_  [4492SK6805EC15]
RL18  4492__SK6805-EC_15_  [4492SK6805EC15]
RL19  4492__SK6805-EC_15_  [4492SK6805EC15]
RL20  4492__SK6805-EC_15_  [4492SK6805EC15]
RL21  4492__SK6805-EC_15_  [4492SK6805EC15]
RL22  4492__SK6805-EC_15_  [4492SK6805EC15]
RL23  4492__SK6805-EC_15_  [4492SK6805EC15]
RL24  4492__SK6805-EC_15_  [4492SK6805EC15]
RL25  4492__SK6805-EC_15_  [4492SK6805EC15]
RL26  4492__SK6805-EC_15_  [4492SK6805EC15]
RL27  4492__SK6805-EC_15_  [4492SK6805EC15]

### Nets
+5V: C9.1 C10.1 C11.1 C12.1 RL1.2(VDD) RL2.2(VDD) RL3.2(VDD) RL4.2(VDD) RL5.2(VDD) RL6.2(VDD) RL7.2(VDD) RL8.2(VDD) RL9.2(VDD) RL10.2(VDD) RL11.2(VDD) RL12.2(VDD) RL13.2(VDD) RL14.2(VDD) RL15.2(VDD) RL16.2(VDD) RL17.2(VDD) RL18.2(VDD) RL19.2(VDD) RL20.2(VDD) RL21.2(VDD) RL22.2(VDD) RL23.2(VDD) RL24.2(VDD) RL25.2(VDD) RL26.2(VDD) RL27.2(VDD) ; also sheet 1,2,3,5,6,7
GND: C9.2 C10.2 C11.2 C12.2 RL1.4(GND) RL2.4(GND) RL3.4(GND) RL4.4(GND) RL5.4(GND) RL6.4(GND) RL7.4(GND) RL8.4(GND) RL9.4(GND) RL10.4(GND) RL11.4(GND) RL12.4(GND) RL13.4(GND) RL14.4(GND) RL15.4(GND) RL16.4(GND) RL17.4(GND) RL18.4(GND) RL19.4(GND) RL20.4(GND) RL21.4(GND) RL22.4(GND) RL23.4(GND) RL24.4(GND) RL25.4(GND) RL26.4(GND) RL27.4(GND) ; also sheet 1,2,3,5,6,7
N$50: RL1.3(DOUT) RL2.1(DIN)
N$51: RL2.3(DOUT) RL3.1(DIN)
N$53: RL3.3(DOUT) RL4.1(DIN)
N$54: RL4.3(DOUT) RL5.1(DIN)
N$55: RL5.3(DOUT) RL6.1(DIN)
N$56: RL6.3(DOUT) RL7.1(DIN)
N$57: RL7.3(DOUT) RL8.1(DIN)
N$58: RL8.3(DOUT) RL9.1(DIN)
N$59: RL9.3(DOUT) RL10.1(DIN)
N$60: RL10.3(DOUT) RL11.1(DIN)
N$61: RL11.3(DOUT) RL12.1(DIN)
N$62: RL12.3(DOUT) RL13.1(DIN)
N$63: RL13.3(DOUT) RL14.1(DIN)
N$64: RL14.3(DOUT) RL15.1(DIN)
N$65: RL15.3(DOUT) RL16.1(DIN)
N$66: RL16.3(DOUT) RL17.1(DIN)
N$67: RL17.3(DOUT) RL18.1(DIN)
N$68: RL18.3(DOUT) RL19.1(DIN)
N$69: RL19.3(DOUT) RL20.1(DIN)
N$70: RL20.3(DOUT) RL21.1(DIN)
N$71: RL21.3(DOUT) RL22.1(DIN)
N$72: RL22.3(DOUT) RL23.1(DIN)
N$73: RL23.3(DOUT) RL24.1(DIN)
N$75: RL25.3(DOUT) RL26.1(DIN)
N$76: RL26.3(DOUT) RL27.1(DIN)
N$87: RL24.3(DOUT) RL25.1(DIN)
N$99: R2.2 RL1.1(DIN)
RED_LINE: R2.1 ; also sheet 2
Unconnected: RL27.3(DOUT)

## Sheet 5 of 7: Yellow Line
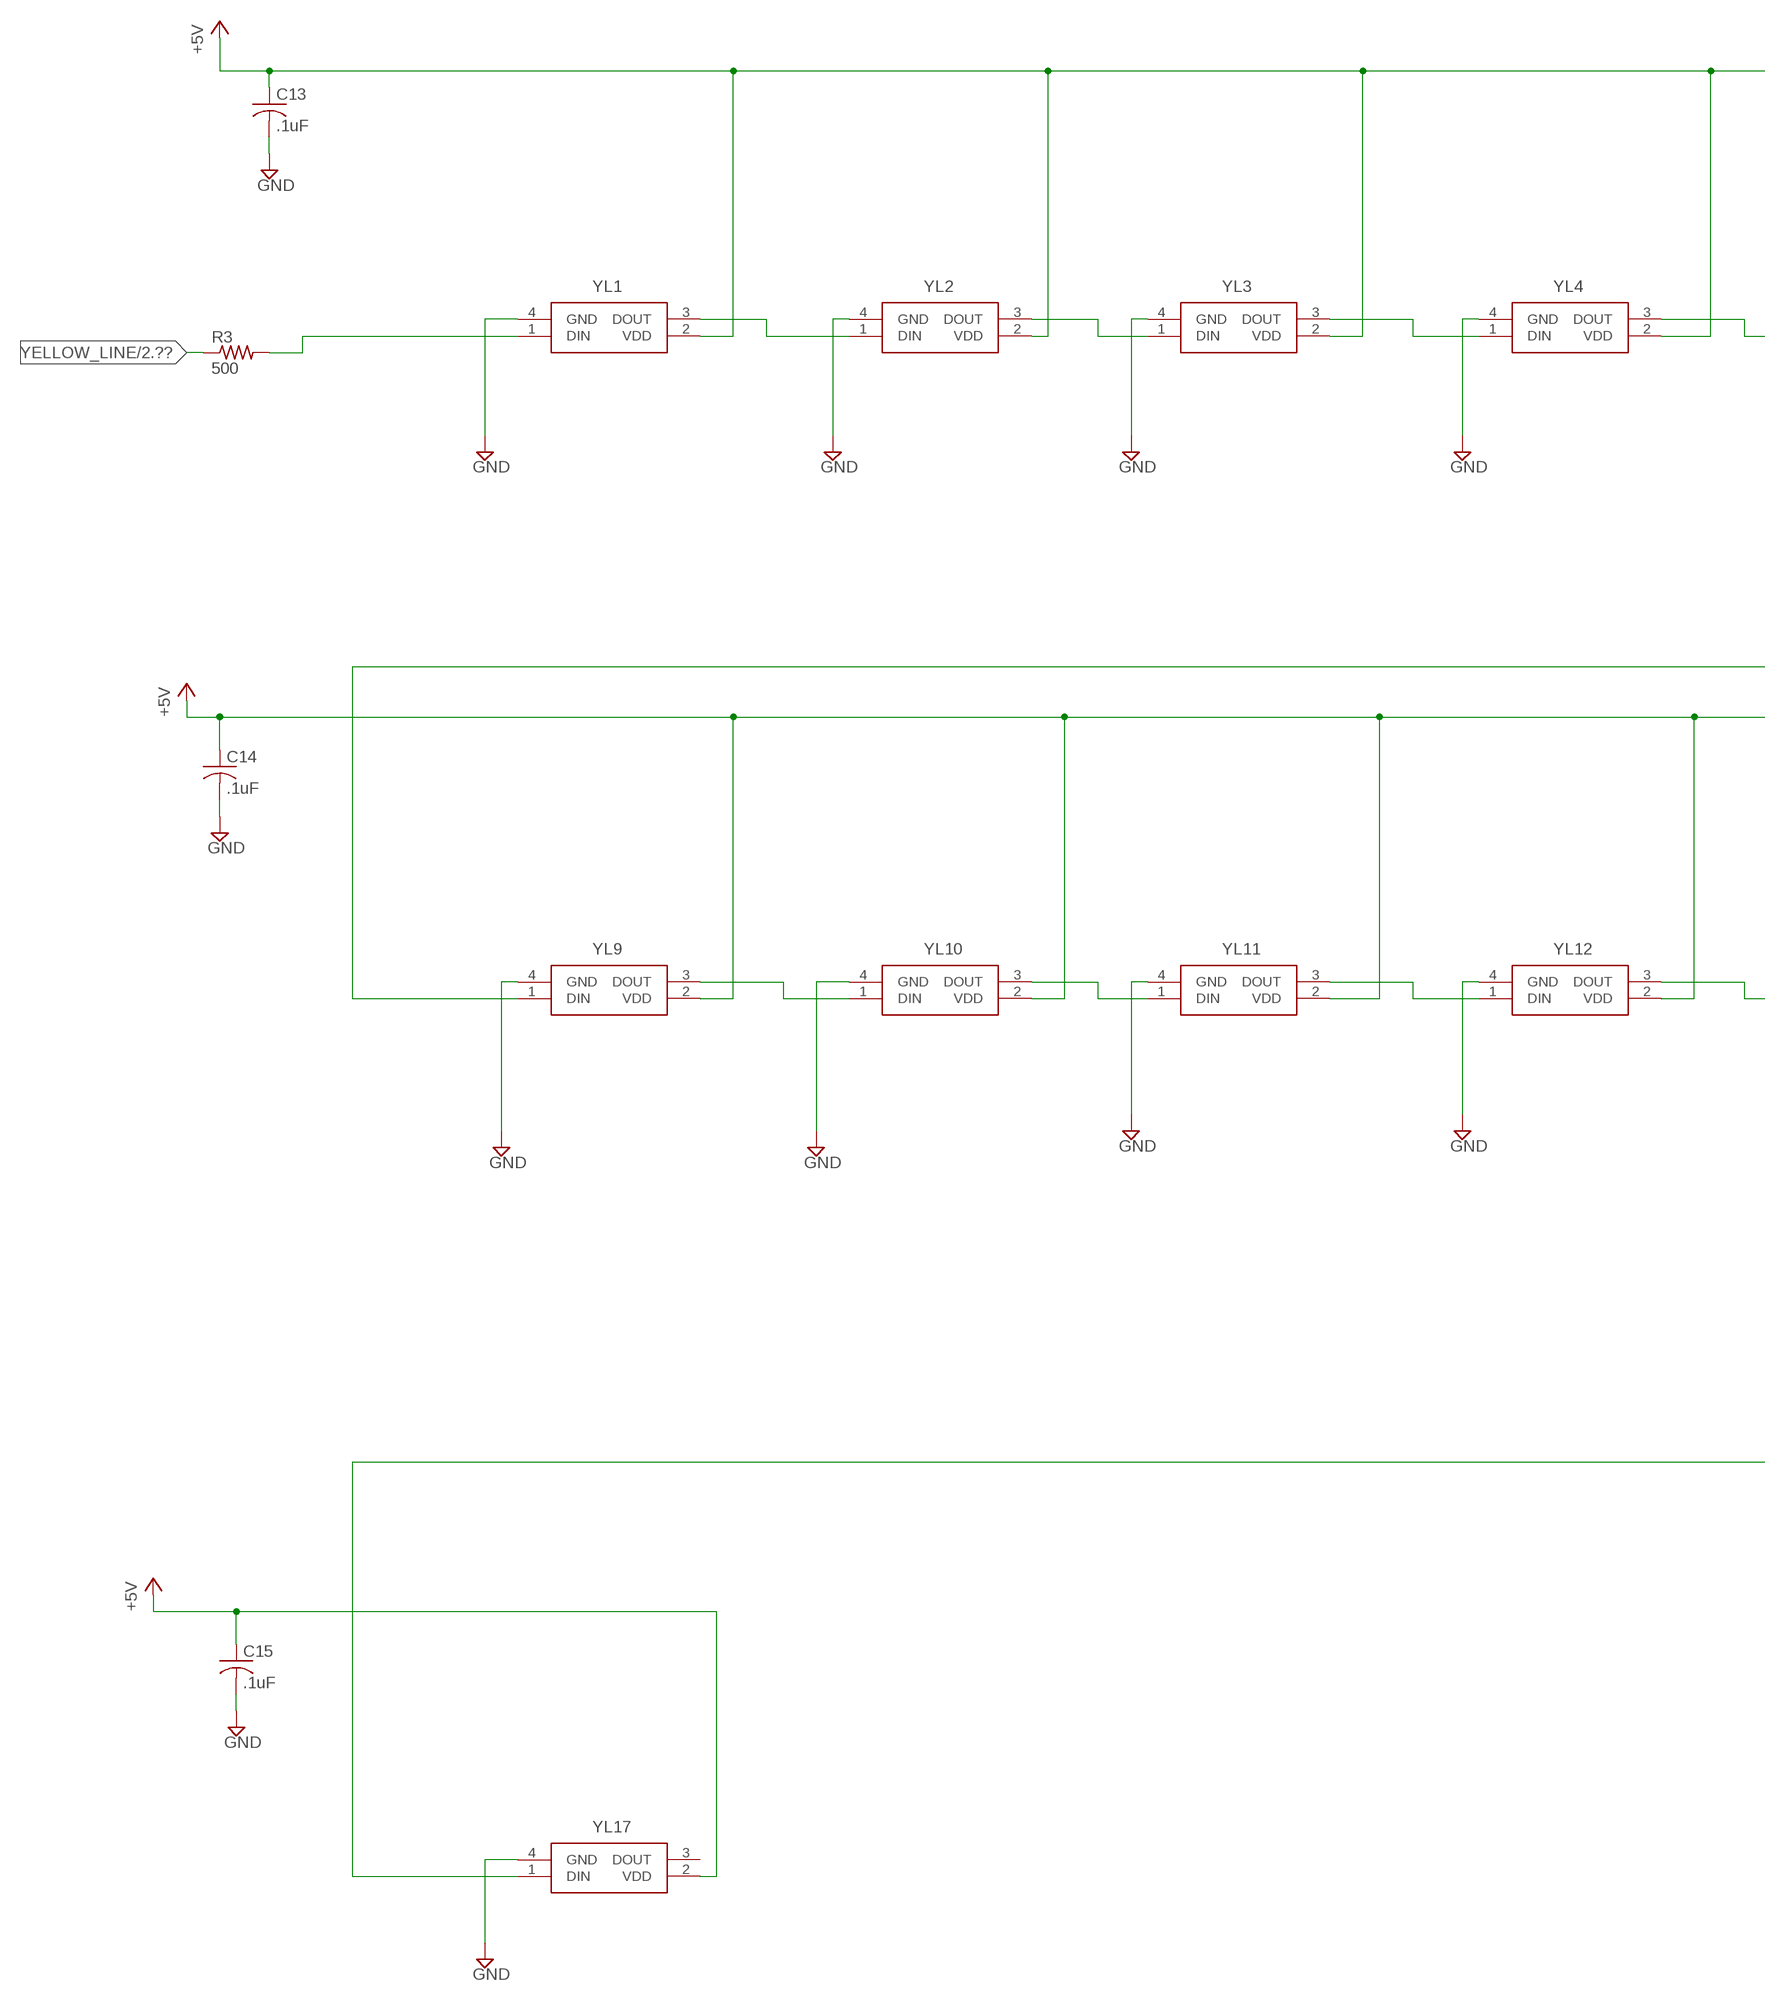
[diagram p9: schematic, sheet 5, part 1 of 2]
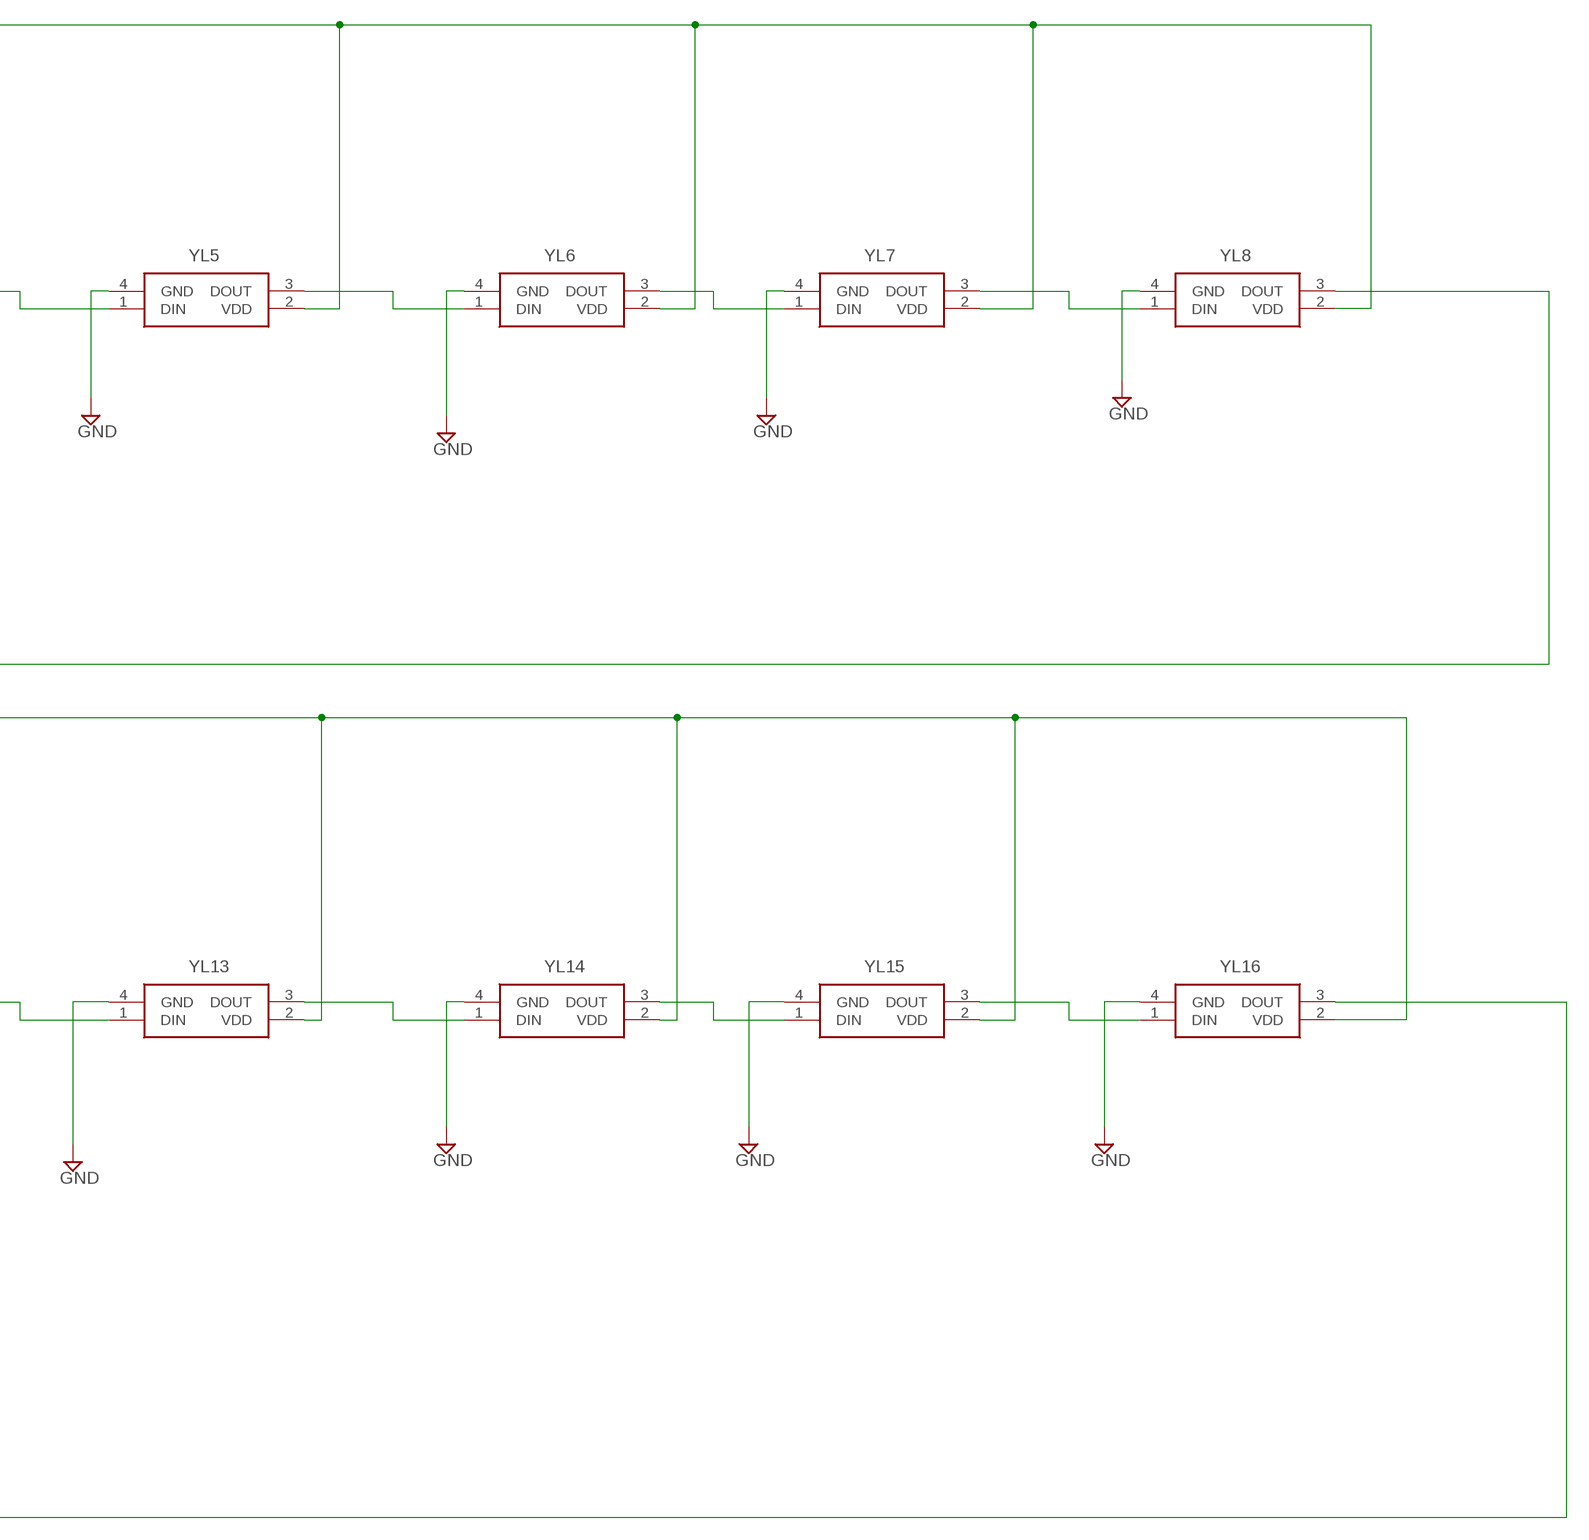
[diagram p10: schematic, sheet 5, part 2 of 2]

### Parts
C13  .1uF  C-USC0805  [C0805]
C14  .1uF  C-USC0805  [C0805]
C15  .1uF  C-USC0805  [C0805]
R3  500  R-US_R0805  [R0805]
YL1  4492__SK6805-EC_15_  [4492SK6805EC15]
YL2  4492__SK6805-EC_15_  [4492SK6805EC15]
YL3  4492__SK6805-EC_15_  [4492SK6805EC15]
YL4  4492__SK6805-EC_15_  [4492SK6805EC15]
YL5  4492__SK6805-EC_15_  [4492SK6805EC15]
YL6  4492__SK6805-EC_15_  [4492SK6805EC15]
YL7  4492__SK6805-EC_15_  [4492SK6805EC15]
YL8  4492__SK6805-EC_15_  [4492SK6805EC15]
YL9  4492__SK6805-EC_15_  [4492SK6805EC15]
YL10  4492__SK6805-EC_15_  [4492SK6805EC15]
YL11  4492__SK6805-EC_15_  [4492SK6805EC15]
YL12  4492__SK6805-EC_15_  [4492SK6805EC15]
YL13  4492__SK6805-EC_15_  [4492SK6805EC15]
YL14  4492__SK6805-EC_15_  [4492SK6805EC15]
YL15  4492__SK6805-EC_15_  [4492SK6805EC15]
YL16  4492__SK6805-EC_15_  [4492SK6805EC15]
YL17  4492__SK6805-EC_15_  [4492SK6805EC15]

### Nets
+5V: C13.1 C14.1 C15.1 YL1.2(VDD) YL2.2(VDD) YL3.2(VDD) YL4.2(VDD) YL5.2(VDD) YL6.2(VDD) YL7.2(VDD) YL8.2(VDD) YL9.2(VDD) YL10.2(VDD) YL11.2(VDD) YL12.2(VDD) YL13.2(VDD) YL14.2(VDD) YL15.2(VDD) YL16.2(VDD) YL17.2(VDD) ; also sheet 1,2,3,4,6,7
GND: C13.2 C14.2 C15.2 YL1.4(GND) YL2.4(GND) YL3.4(GND) YL4.4(GND) YL5.4(GND) YL6.4(GND) YL7.4(GND) YL8.4(GND) YL9.4(GND) YL10.4(GND) YL11.4(GND) YL12.4(GND) YL13.4(GND) YL14.4(GND) YL15.4(GND) YL16.4(GND) YL17.4(GND) ; also sheet 1,2,3,4,6,7
N$74: YL1.3(DOUT) YL2.1(DIN)
N$77: YL2.3(DOUT) YL3.1(DIN)
N$78: YL3.3(DOUT) YL4.1(DIN)
N$79: YL4.3(DOUT) YL5.1(DIN)
N$80: YL5.3(DOUT) YL6.1(DIN)
N$81: YL6.3(DOUT) YL7.1(DIN)
N$82: YL7.3(DOUT) YL8.1(DIN)
N$83: YL8.3(DOUT) YL9.1(DIN)
N$84: YL9.3(DOUT) YL10.1(DIN)
N$85: YL10.3(DOUT) YL11.1(DIN)
N$86: YL11.3(DOUT) YL12.1(DIN)
N$88: YL12.3(DOUT) YL13.1(DIN)
N$89: YL13.3(DOUT) YL14.1(DIN)
N$90: YL14.3(DOUT) YL15.1(DIN)
N$91: YL15.3(DOUT) YL16.1(DIN)
N$92: YL16.3(DOUT) YL17.1(DIN)
N$126: R3.2 YL1.1(DIN)
YELLOW_LINE: R3.1 ; also sheet 2
Unconnected: YL17.3(DOUT)

## Sheet 6 of 7: Green Line
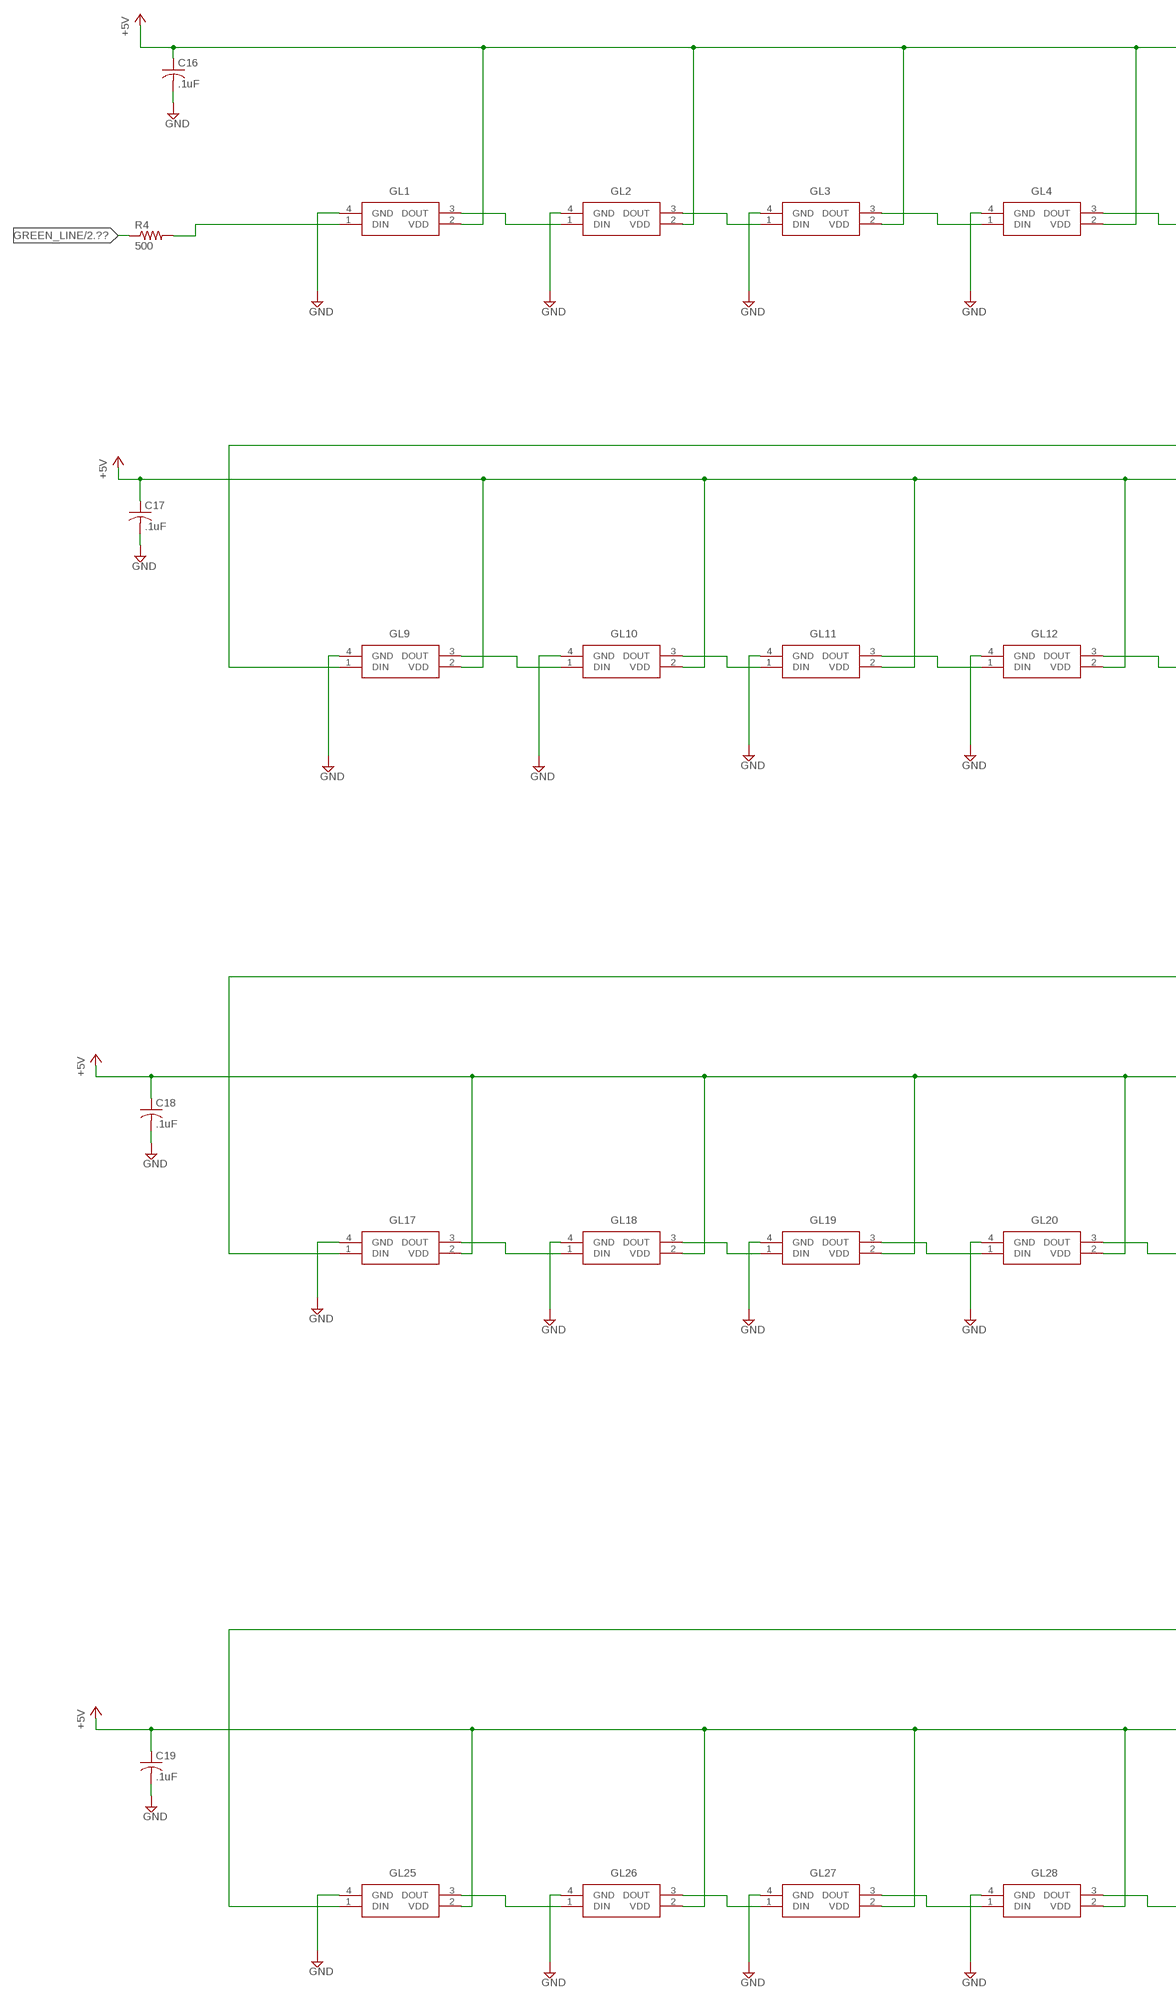
[diagram p11: schematic, sheet 6, part 1 of 2]
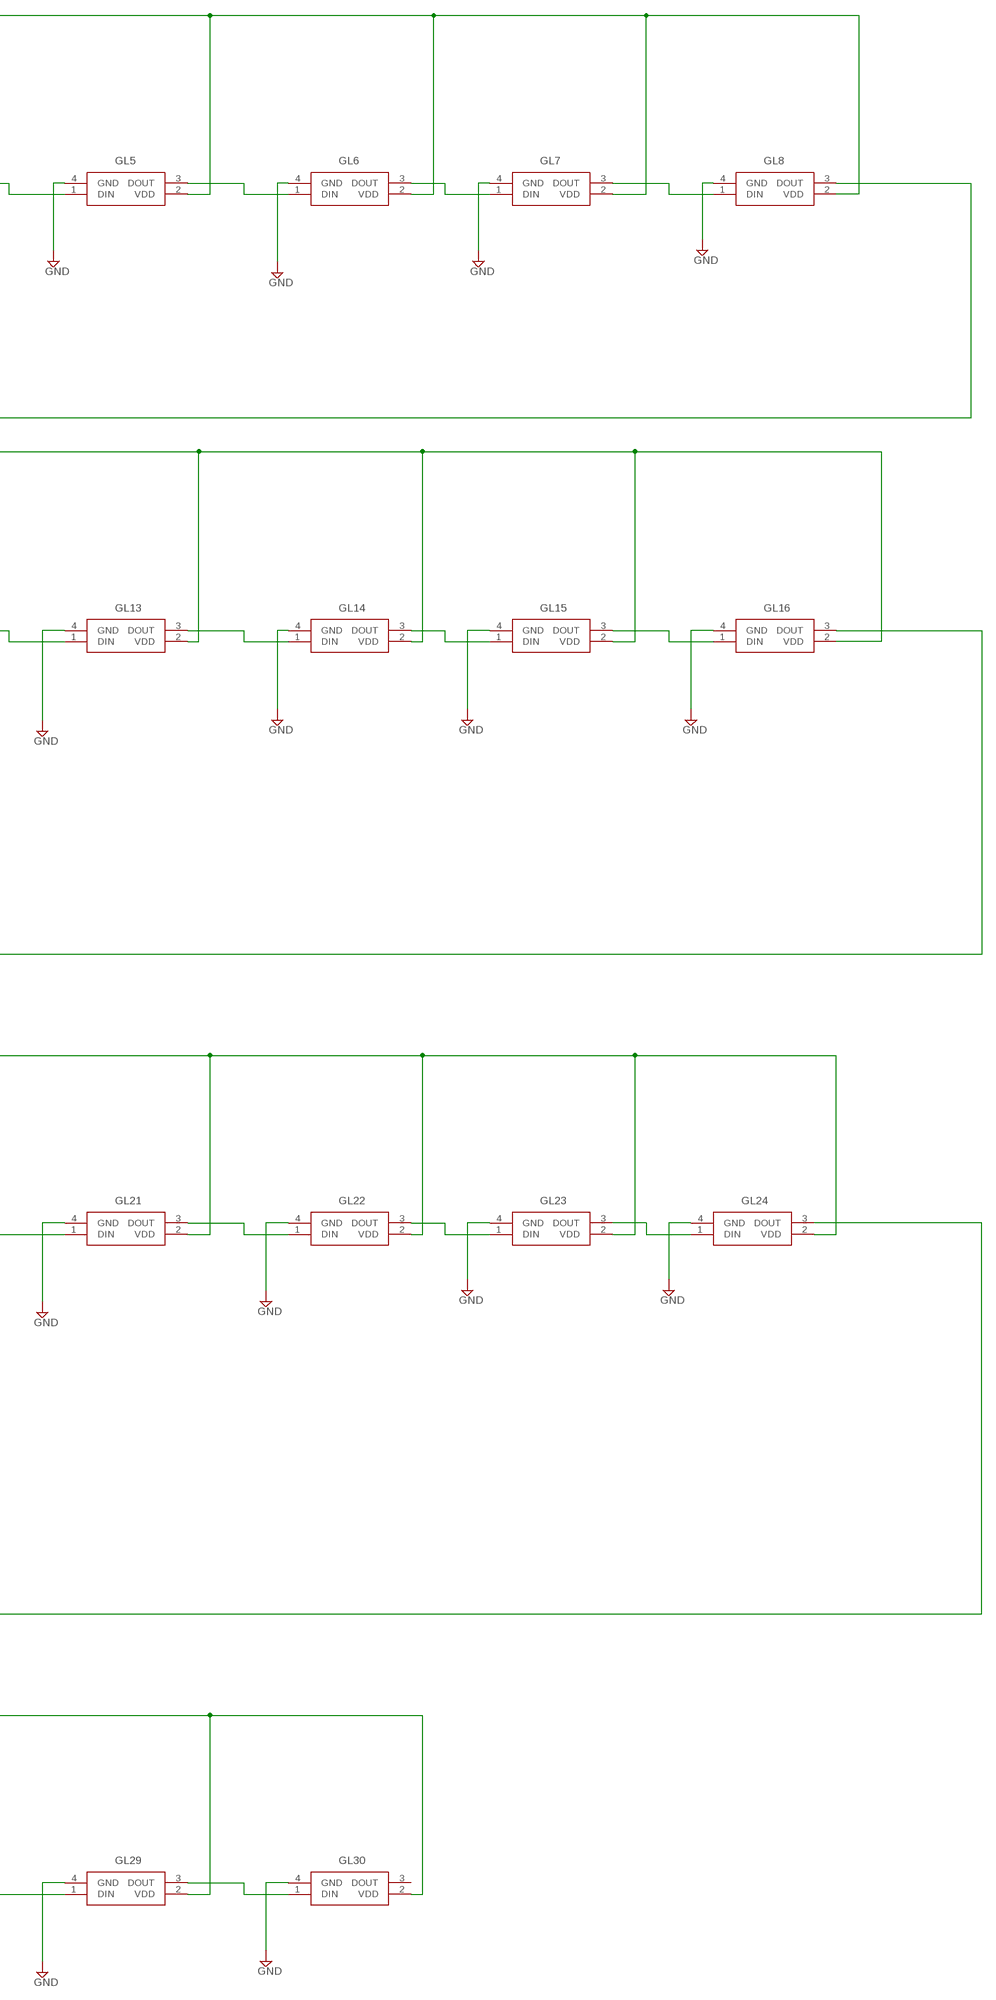
[diagram p12: schematic, sheet 6, part 2 of 2]

### Parts
C16  .1uF  C-USC0805  [C0805]
C17  .1uF  C-USC0805  [C0805]
C18  .1uF  C-USC0805  [C0805]
C19  .1uF  C-USC0805  [C0805]
GL1  4492__SK6805-EC_15_  [4492SK6805EC15]
GL2  4492__SK6805-EC_15_  [4492SK6805EC15]
GL3  4492__SK6805-EC_15_  [4492SK6805EC15]
GL4  4492__SK6805-EC_15_  [4492SK6805EC15]
GL5  4492__SK6805-EC_15_  [4492SK6805EC15]
GL6  4492__SK6805-EC_15_  [4492SK6805EC15]
GL7  4492__SK6805-EC_15_  [4492SK6805EC15]
GL8  4492__SK6805-EC_15_  [4492SK6805EC15]
GL9  4492__SK6805-EC_15_  [4492SK6805EC15]
GL10  4492__SK6805-EC_15_  [4492SK6805EC15]
GL11  4492__SK6805-EC_15_  [4492SK6805EC15]
GL12  4492__SK6805-EC_15_  [4492SK6805EC15]
GL13  4492__SK6805-EC_15_  [4492SK6805EC15]
GL14  4492__SK6805-EC_15_  [4492SK6805EC15]
GL15  4492__SK6805-EC_15_  [4492SK6805EC15]
GL16  4492__SK6805-EC_15_  [4492SK6805EC15]
GL17  4492__SK6805-EC_15_  [4492SK6805EC15]
GL18  4492__SK6805-EC_15_  [4492SK6805EC15]
GL19  4492__SK6805-EC_15_  [4492SK6805EC15]
GL20  4492__SK6805-EC_15_  [4492SK6805EC15]
GL21  4492__SK6805-EC_15_  [4492SK6805EC15]
GL22  4492__SK6805-EC_15_  [4492SK6805EC15]
GL23  4492__SK6805-EC_15_  [4492SK6805EC15]
GL24  4492__SK6805-EC_15_  [4492SK6805EC15]
GL25  4492__SK6805-EC_15_  [4492SK6805EC15]
GL26  4492__SK6805-EC_15_  [4492SK6805EC15]
GL27  4492__SK6805-EC_15_  [4492SK6805EC15]
GL28  4492__SK6805-EC_15_  [4492SK6805EC15]
GL29  4492__SK6805-EC_15_  [4492SK6805EC15]
GL30  4492__SK6805-EC_15_  [4492SK6805EC15]
R4  500  R-US_R0805  [R0805]

### Nets
+5V: C16.1 C17.1 C18.1 C19.1 GL1.2(VDD) GL2.2(VDD) GL3.2(VDD) GL4.2(VDD) GL5.2(VDD) GL6.2(VDD) GL7.2(VDD) GL8.2(VDD) GL9.2(VDD) GL10.2(VDD) GL11.2(VDD) GL12.2(VDD) GL13.2(VDD) GL14.2(VDD) GL15.2(VDD) GL16.2(VDD) GL17.2(VDD) GL18.2(VDD) GL19.2(VDD) GL20.2(VDD) GL21.2(VDD) GL22.2(VDD) GL23.2(VDD) GL24.2(VDD) GL25.2(VDD) GL26.2(VDD) GL27.2(VDD) GL28.2(VDD) GL29.2(VDD) GL30.2(VDD) ; also sheet 1,2,3,4,5,7
GND: C16.2 C17.2 C18.2 C19.2 GL1.4(GND) GL2.4(GND) GL3.4(GND) GL4.4(GND) GL5.4(GND) GL6.4(GND) GL7.4(GND) GL8.4(GND) GL9.4(GND) GL10.4(GND) GL11.4(GND) GL12.4(GND) GL13.4(GND) GL14.4(GND) GL15.4(GND) GL16.4(GND) GL17.4(GND) GL18.4(GND) GL19.4(GND) GL20.4(GND) GL21.4(GND) GL22.4(GND) GL23.4(GND) GL24.4(GND) GL25.4(GND) GL26.4(GND) GL27.4(GND) GL28.4(GND) GL29.4(GND) GL30.4(GND) ; also sheet 1,2,3,4,5,7
GREEN_LINE: R4.1 ; also sheet 2
N$93: GL1.3(DOUT) GL2.1(DIN)
N$94: GL2.3(DOUT) GL3.1(DIN)
N$95: GL3.3(DOUT) GL4.1(DIN)
N$96: GL4.3(DOUT) GL5.1(DIN)
N$97: GL5.3(DOUT) GL6.1(DIN)
N$98: GL6.3(DOUT) GL7.1(DIN)
N$100: GL7.3(DOUT) GL8.1(DIN)
N$101: GL8.3(DOUT) GL9.1(DIN)
N$102: GL9.3(DOUT) GL10.1(DIN)
N$103: GL10.3(DOUT) GL11.1(DIN)
N$104: GL11.3(DOUT) GL12.1(DIN)
N$105: GL12.3(DOUT) GL13.1(DIN)
N$106: GL13.3(DOUT) GL14.1(DIN)
N$107: GL14.3(DOUT) GL15.1(DIN)
N$108: GL15.3(DOUT) GL16.1(DIN)
N$109: GL16.3(DOUT) GL17.1(DIN)
N$110: GL17.3(DOUT) GL18.1(DIN)
N$111: GL18.3(DOUT) GL19.1(DIN)
N$112: GL19.3(DOUT) GL20.1(DIN)
N$113: GL20.3(DOUT) GL21.1(DIN)
N$114: GL21.3(DOUT) GL22.1(DIN)
N$115: GL22.3(DOUT) GL23.1(DIN)
N$116: GL24.3(DOUT) GL25.1(DIN)
N$117: GL25.3(DOUT) GL26.1(DIN)
N$118: GL26.3(DOUT) GL27.1(DIN)
N$119: GL27.3(DOUT) GL28.1(DIN)
N$120: GL28.3(DOUT) GL29.1(DIN)
N$121: GL29.3(DOUT) GL30.1(DIN)
N$123: GL23.3(DOUT) GL24.1(DIN)
N$143: GL1.1(DIN) R4.2
Unconnected: GL30.3(DOUT)

## Sheet 7 of 7: Orange Line
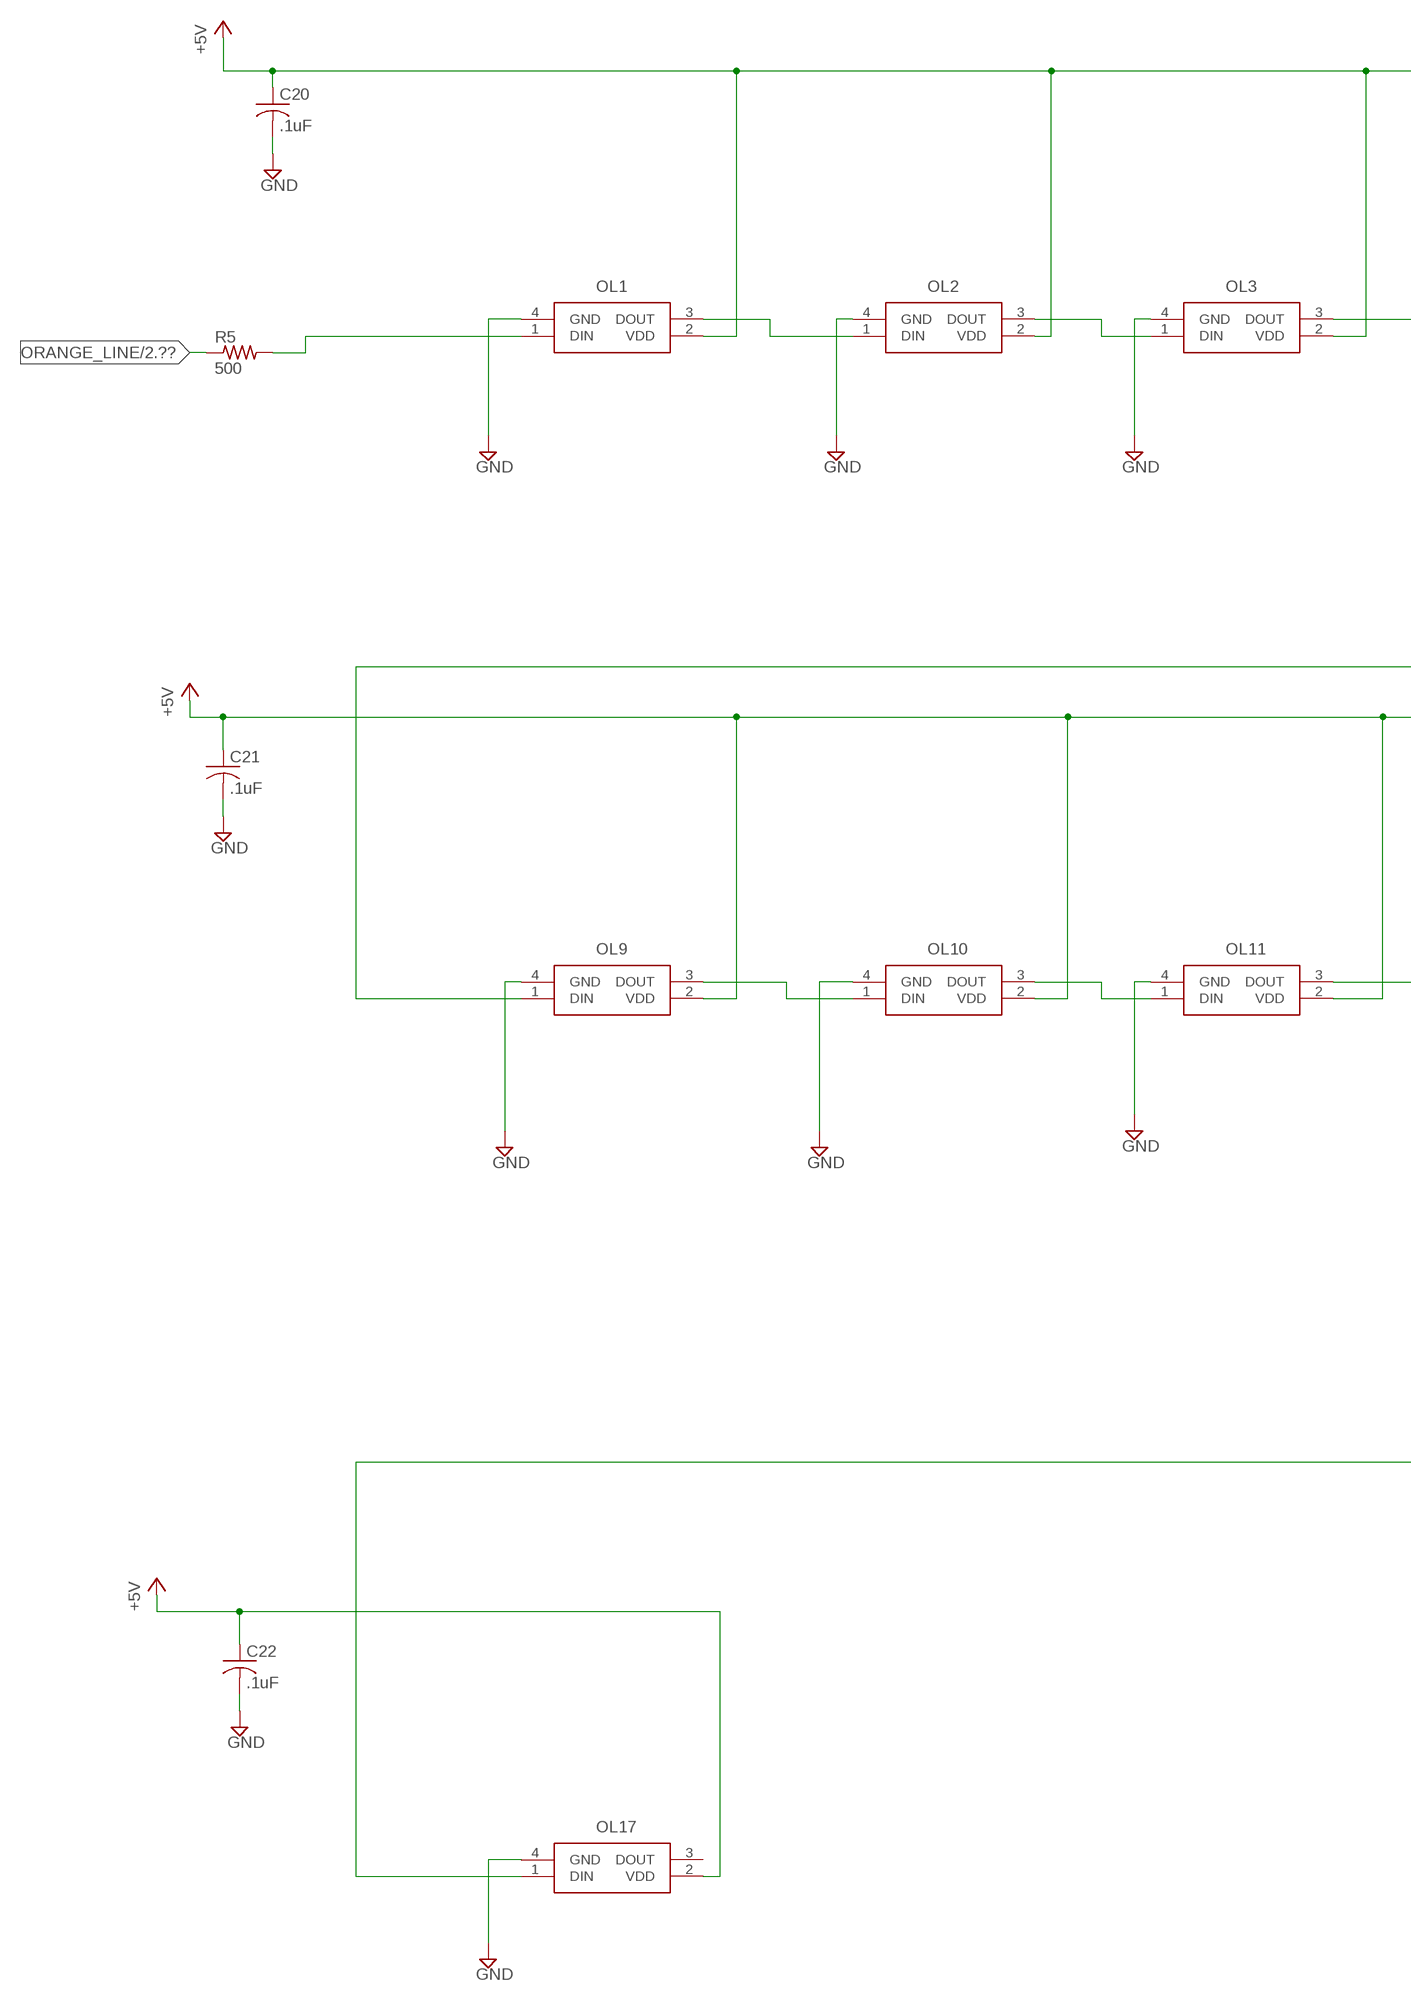
[diagram p13: schematic, sheet 7, part 1 of 2]
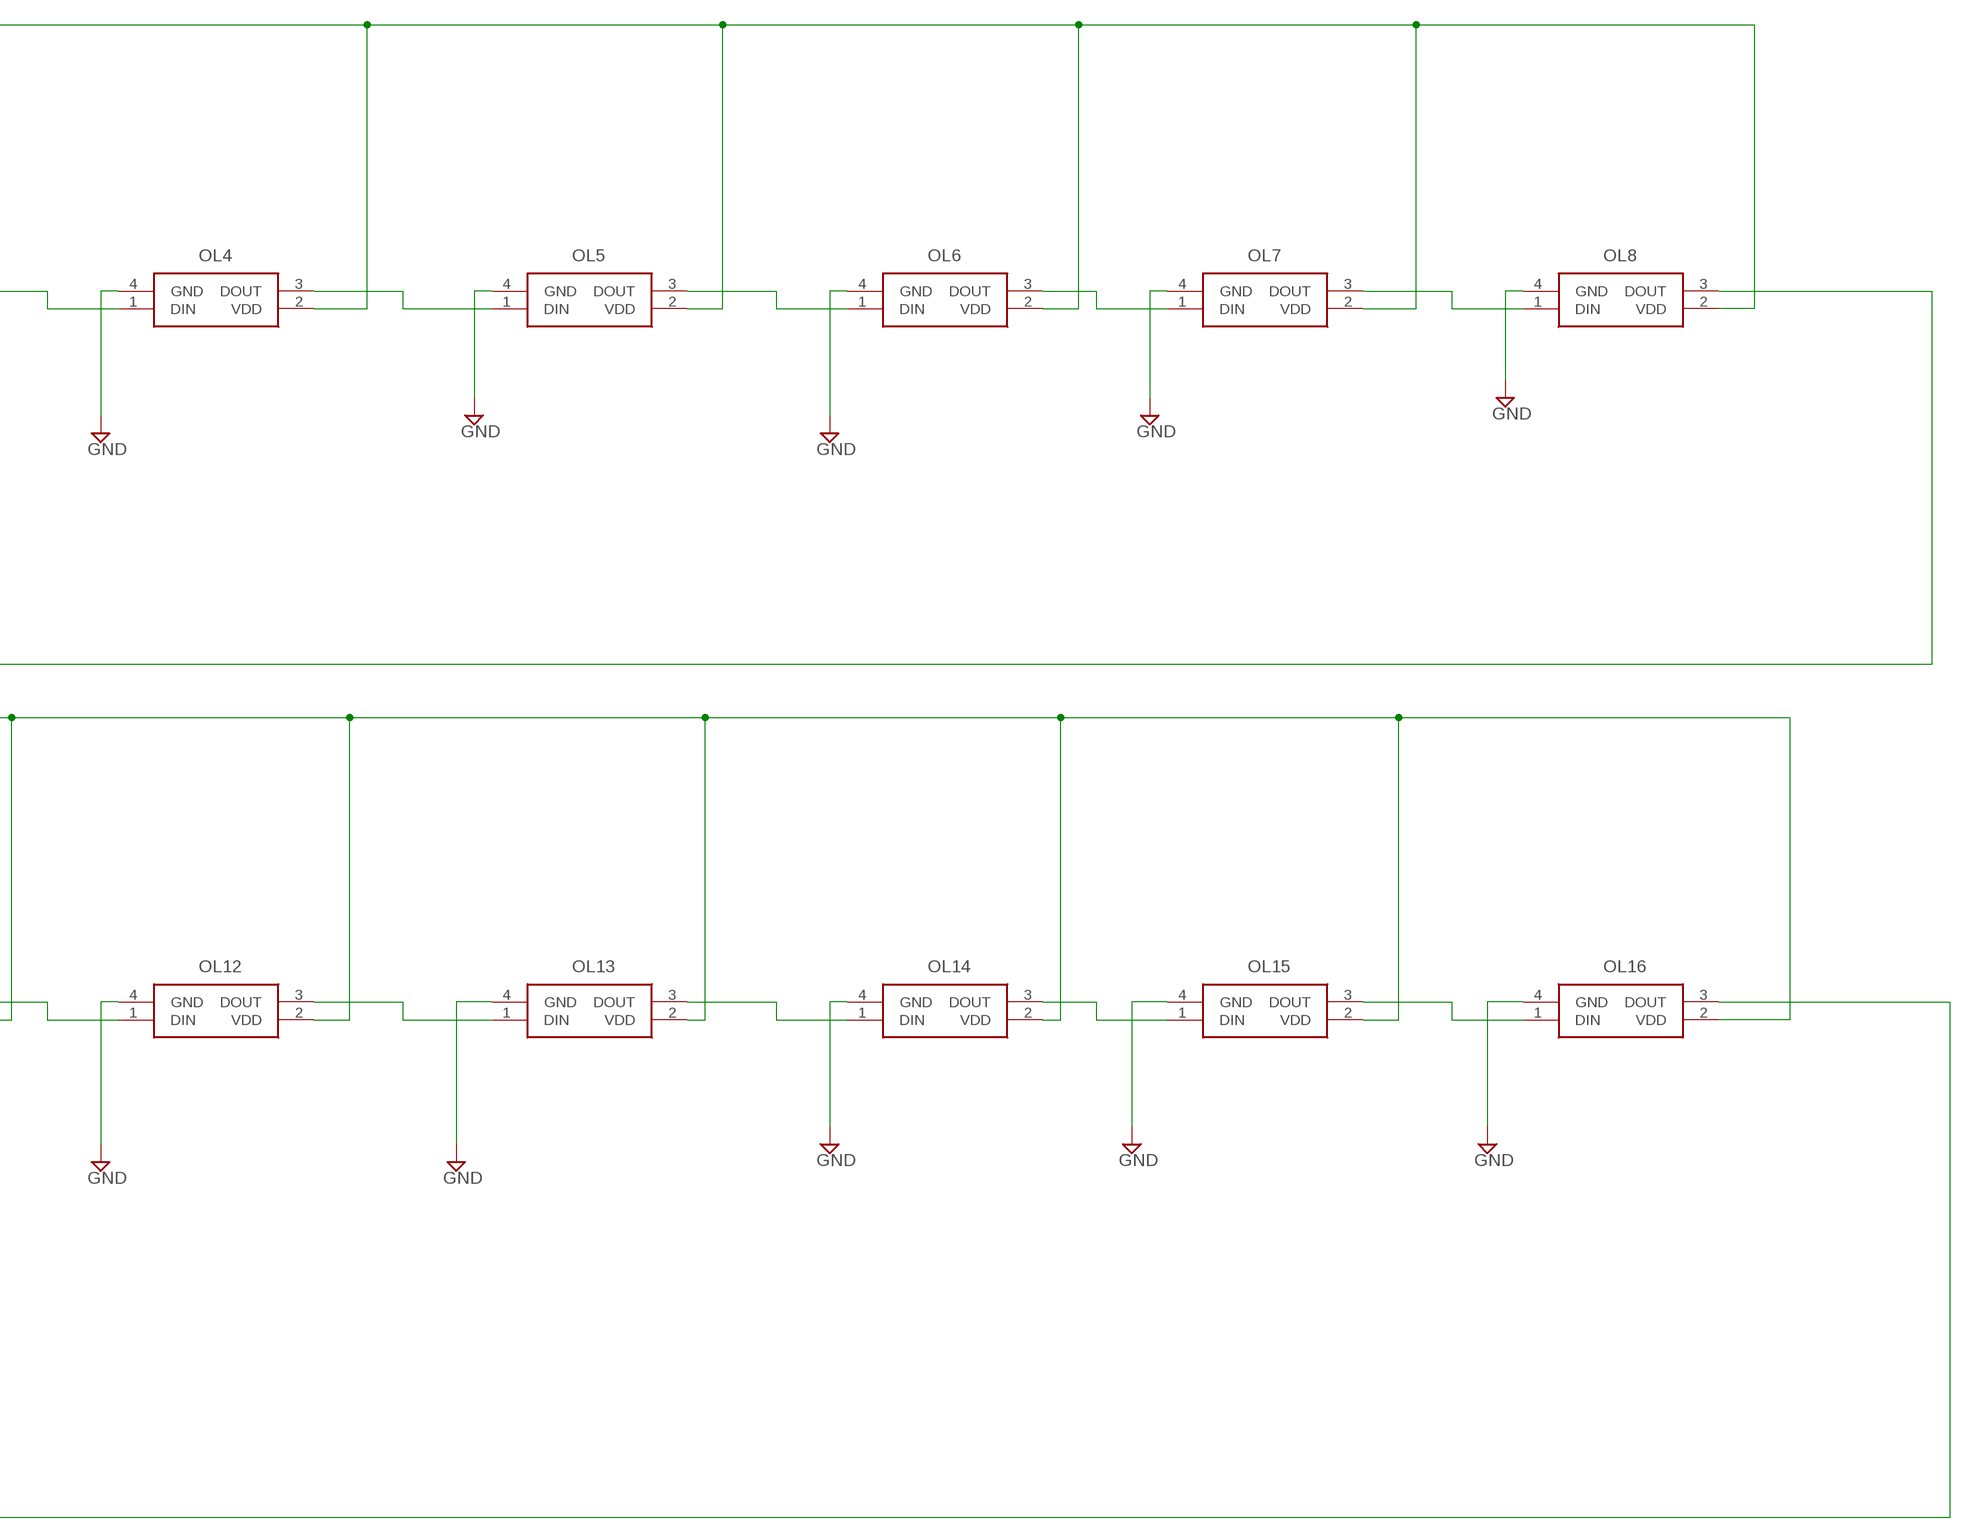
[diagram p14: schematic, sheet 7, part 2 of 2]

### Parts
C20  .1uF  C-USC0805  [C0805]
C21  .1uF  C-USC0805  [C0805]
C22  .1uF  C-USC0805  [C0805]
OL1  4492__SK6805-EC_15_  [4492SK6805EC15]
OL2  4492__SK6805-EC_15_  [4492SK6805EC15]
OL3  4492__SK6805-EC_15_  [4492SK6805EC15]
OL4  4492__SK6805-EC_15_  [4492SK6805EC15]
OL5  4492__SK6805-EC_15_  [4492SK6805EC15]
OL6  4492__SK6805-EC_15_  [4492SK6805EC15]
OL7  4492__SK6805-EC_15_  [4492SK6805EC15]
OL8  4492__SK6805-EC_15_  [4492SK6805EC15]
OL9  4492__SK6805-EC_15_  [4492SK6805EC15]
OL10  4492__SK6805-EC_15_  [4492SK6805EC15]
OL11  4492__SK6805-EC_15_  [4492SK6805EC15]
OL12  4492__SK6805-EC_15_  [4492SK6805EC15]
OL13  4492__SK6805-EC_15_  [4492SK6805EC15]
OL14  4492__SK6805-EC_15_  [4492SK6805EC15]
OL15  4492__SK6805-EC_15_  [4492SK6805EC15]
OL16  4492__SK6805-EC_15_  [4492SK6805EC15]
OL17  4492__SK6805-EC_15_  [4492SK6805EC15]
R5  500  R-US_R0805  [R0805]

### Nets
+5V: C20.1 C21.1 C22.1 OL1.2(VDD) OL2.2(VDD) OL3.2(VDD) OL4.2(VDD) OL5.2(VDD) OL6.2(VDD) OL7.2(VDD) OL8.2(VDD) OL9.2(VDD) OL10.2(VDD) OL11.2(VDD) OL12.2(VDD) OL13.2(VDD) OL14.2(VDD) OL15.2(VDD) OL16.2(VDD) OL17.2(VDD) ; also sheet 1,2,3,4,5,6
GND: C20.2 C21.2 C22.2 OL1.4(GND) OL2.4(GND) OL3.4(GND) OL4.4(GND) OL5.4(GND) OL6.4(GND) OL7.4(GND) OL8.4(GND) OL9.4(GND) OL10.4(GND) OL11.4(GND) OL12.4(GND) OL13.4(GND) OL14.4(GND) OL15.4(GND) OL16.4(GND) OL17.4(GND) ; also sheet 1,2,3,4,5,6
N$122: OL1.3(DOUT) OL2.1(DIN)
N$124: OL2.3(DOUT) OL3.1(DIN)
N$125: OL3.3(DOUT) OL4.1(DIN)
N$127: OL4.3(DOUT) OL5.1(DIN)
N$128: OL5.3(DOUT) OL6.1(DIN)
N$129: OL6.3(DOUT) OL7.1(DIN)
N$130: OL7.3(DOUT) OL8.1(DIN)
N$131: OL8.3(DOUT) OL9.1(DIN)
N$132: OL9.3(DOUT) OL10.1(DIN)
N$133: OL10.3(DOUT) OL11.1(DIN)
N$134: OL11.3(DOUT) OL12.1(DIN)
N$135: OL12.3(DOUT) OL13.1(DIN)
N$136: OL13.3(DOUT) OL14.1(DIN)
N$137: OL14.3(DOUT) OL15.1(DIN)
N$138: OL15.3(DOUT) OL16.1(DIN)
N$139: OL16.3(DOUT) OL17.1(DIN)
N$140: OL1.1(DIN) R5.2
ORANGE_LINE: R5.1 ; also sheet 2
Unconnected: OL17.3(DOUT)

## Power pins joined to a net without a drawn wire
EXT_5V: U1.19(EXT_5V)

## Library data of the parts
BARREL_JACK1 = adafruit:2.1MMJACK: 2.1mm x 5.5mm THM DC jack with internal switch. Digikey part #PJ-102A, 4UCON part #05537 2.1mm x 5.5mm SMT DC jack with internal switch. Digikey part #PJ-002A-SMT, 4UCON part #03267 By microbuilder.eu & adafruit.com
BL1-BL49 GL1-GL30 OL1-OL17 RL1-RL27 YL1-YL17 = SamacSys_Parts:4492__SK6805-EC_15_: Addressable Lighting series 10 LED Discrete - Red, Green, Blue (RGB) 1.50mm L x 1.50mm W Source: Datasheet <https://cdn-shop.adafruit.com/product-files/4492/Datasheet.pdf>; DESCRIPTION: Addressable Lighting series 10 LED Discrete - Red, Green, Blue (RGB) 1.50mm L x 1.50mm W; HEIGHT: 0.75mm; MANUFACTURER_NAME: Adafruit; MANUFACTURER_PART_NUMBER: 4492 (SK6805-EC 15)
C1-C22 = rcl:C-US: CAPACITOR, American symbol; SPICEPREFIX: C
IC1 IC2 = SamacSys_Parts:TXU0304PWR: Translation - Voltage Levels Four channel unidirectional level shifter Source: Datasheet <https://www.ti.com/lit/ds/symlink/txu0304.pdf?ts=1627717511667&ref_url=https%3A%2F%2Fwww.ti.com%2Fproduct%2FTXU0304>; DESCRIPTION: Translation - Voltage Levels Four channel unidirectional level shifter; HEIGHT: 1.2mm; MANUFACTURER_NAME: Texas Instruments; MANUFACTURER_PART_NUMBER: TXU0304PWR; MOUSER_PART_NUMBER: 595-TXU0304PWR; MOUSER_PRICE-STOCK: https://www.mouser.co.uk/ProductDetail/Texas-Instruments/TXU0304PWR?qs=QNEnbhJQKvZVYXIKZoXs0A%3D%3D
JP1 = pinhead:PINHD-1X2: PIN HEADER
R1-R5 = adafruit:R-US_: RESISTOR, American symbol
U1 = ESP32-DEVKITC-32D:ESP32-DEVKITC-32D: Eval Board For Esp-Wroom-32 Check prices <https://pricing.snapeda.com/parts/ESP32-DEVKITC-32D/Espressif%20Systems/view-part?ref=eda>; AVAILABILITY: In Stock; DESCRIPTION: WiFi Development Tools (802.11) ESP32 General Development Kit, ESP32-WROOM-32D on the board; MF: Espressif Systems; MP: ESP32-DEVKITC-32D; PACKAGE: None; PRICE: None; PURCHASE-URL: https://pricing.snapeda.com/search/part/ESP32-DEVKITC-32D/?ref=eda
VOLTAGE_REG = SamacSys_Parts:TLS850B0TBV33ATMA1: INFINEON - TLS850B0TBV33ATMA1 - LDO, AEC-Q100, FIXED, 3.3V, 0.5A, TO-263 Source: Datasheet <https://www.infineon.com/dgdl/Infineon-TLS850B0TB V33-DS-v01_00-EN.pdf?fileId=5546d4625fe3678401600cf0f9cb6d40>; DESCRIPTION: INFINEON - TLS850B0TBV33ATMA1 - LDO, AEC-Q100, FIXED, 3.3V, 0.5A, TO-263; HEIGHT: 4.4mm; MANUFACTURER_NAME: Infineon; MANUFACTURER_PART_NUMBER: TLS850B0TBV33ATMA1; MOUSER_PART_NUMBER: 726-TLS850B0TBV33ATM; MOUSER_PRICE-STOCK: https://www.mouser.co.uk/ProductDetail/Infineon-Technologies/TLS850B0TBV33ATMA1?qs=W0yvOO0ixfF82ywpAVrG4Q%3D%3D

## Net classes
1 5v_power: width 1 mm